# EasyEDA Pro project EasyEDAPro-Schematic.epro, schematic main, sheets 1 to 4 of 7

## Sheets
1 main_blocks: Create Date: 2024-01-20; Page Name: main_blocks.Schematic1; Project Name: flipper; Schematic Name: Schematic1; Update Date: 2024-01-20; Company: 嘉立创EDA; Page Size: A4; Version: V1.0
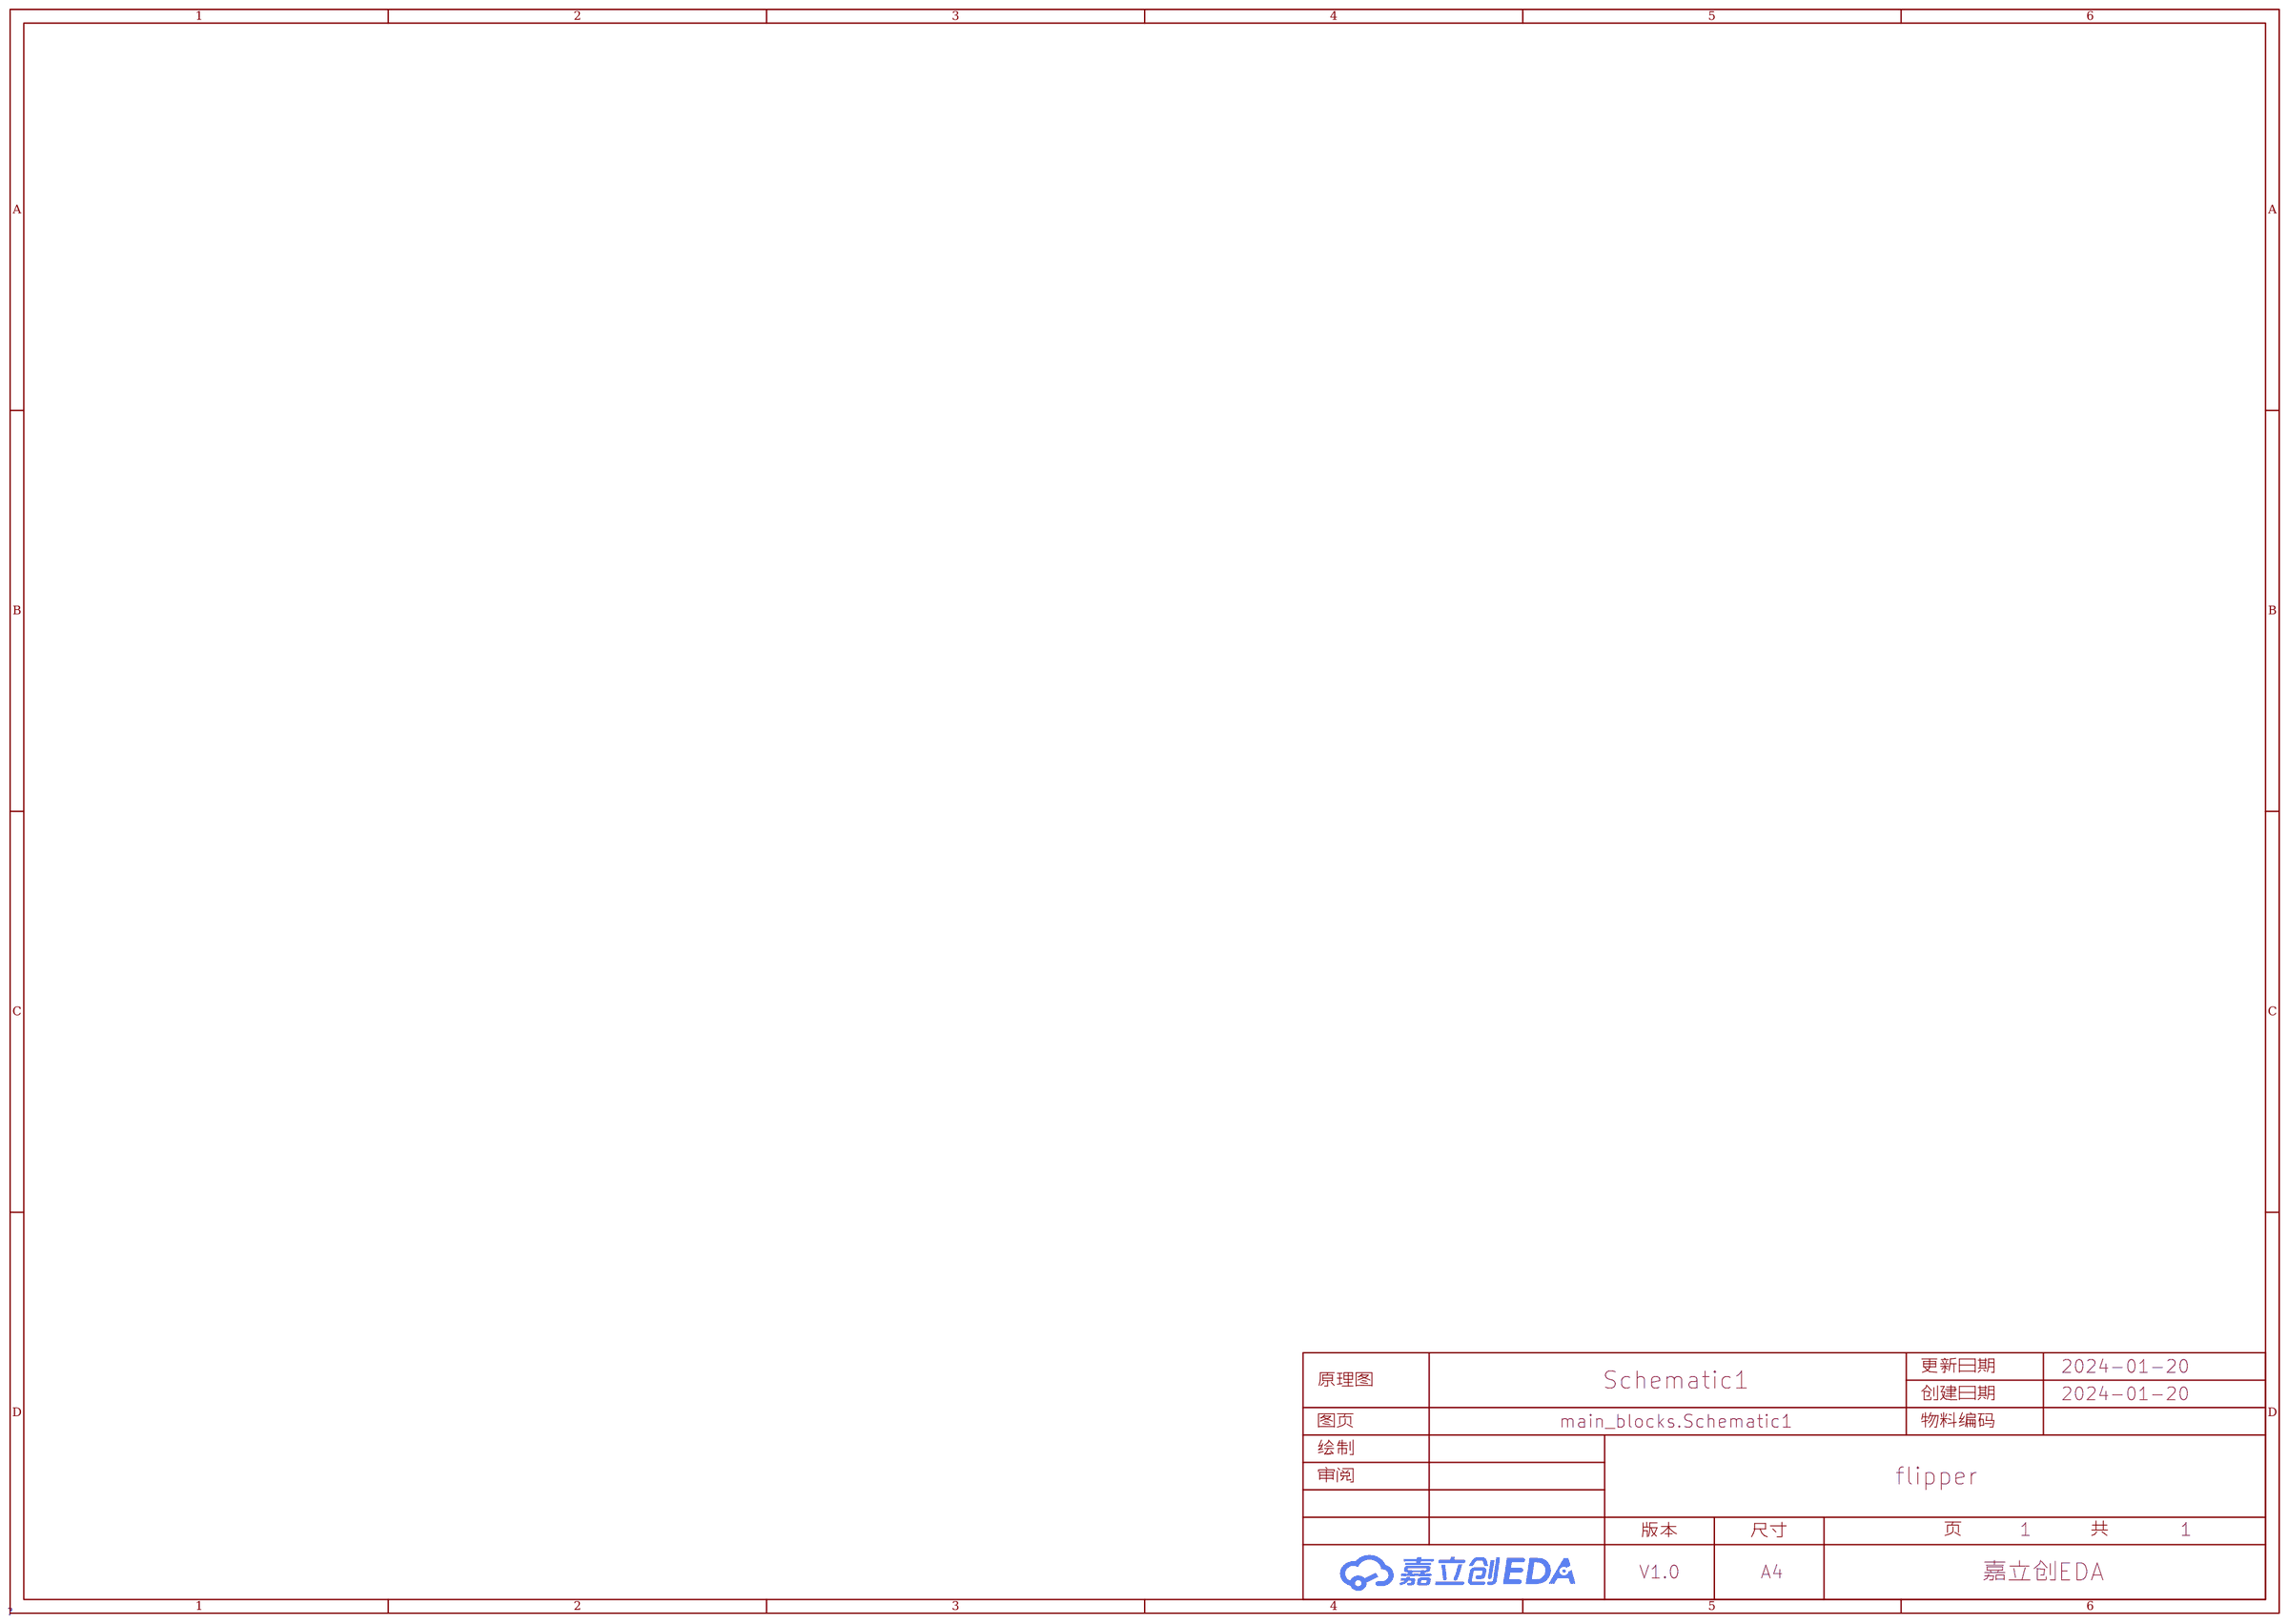
[diagram p0: main_blocks]
2 power: Page Name: power; Update Date: 2024-01-23
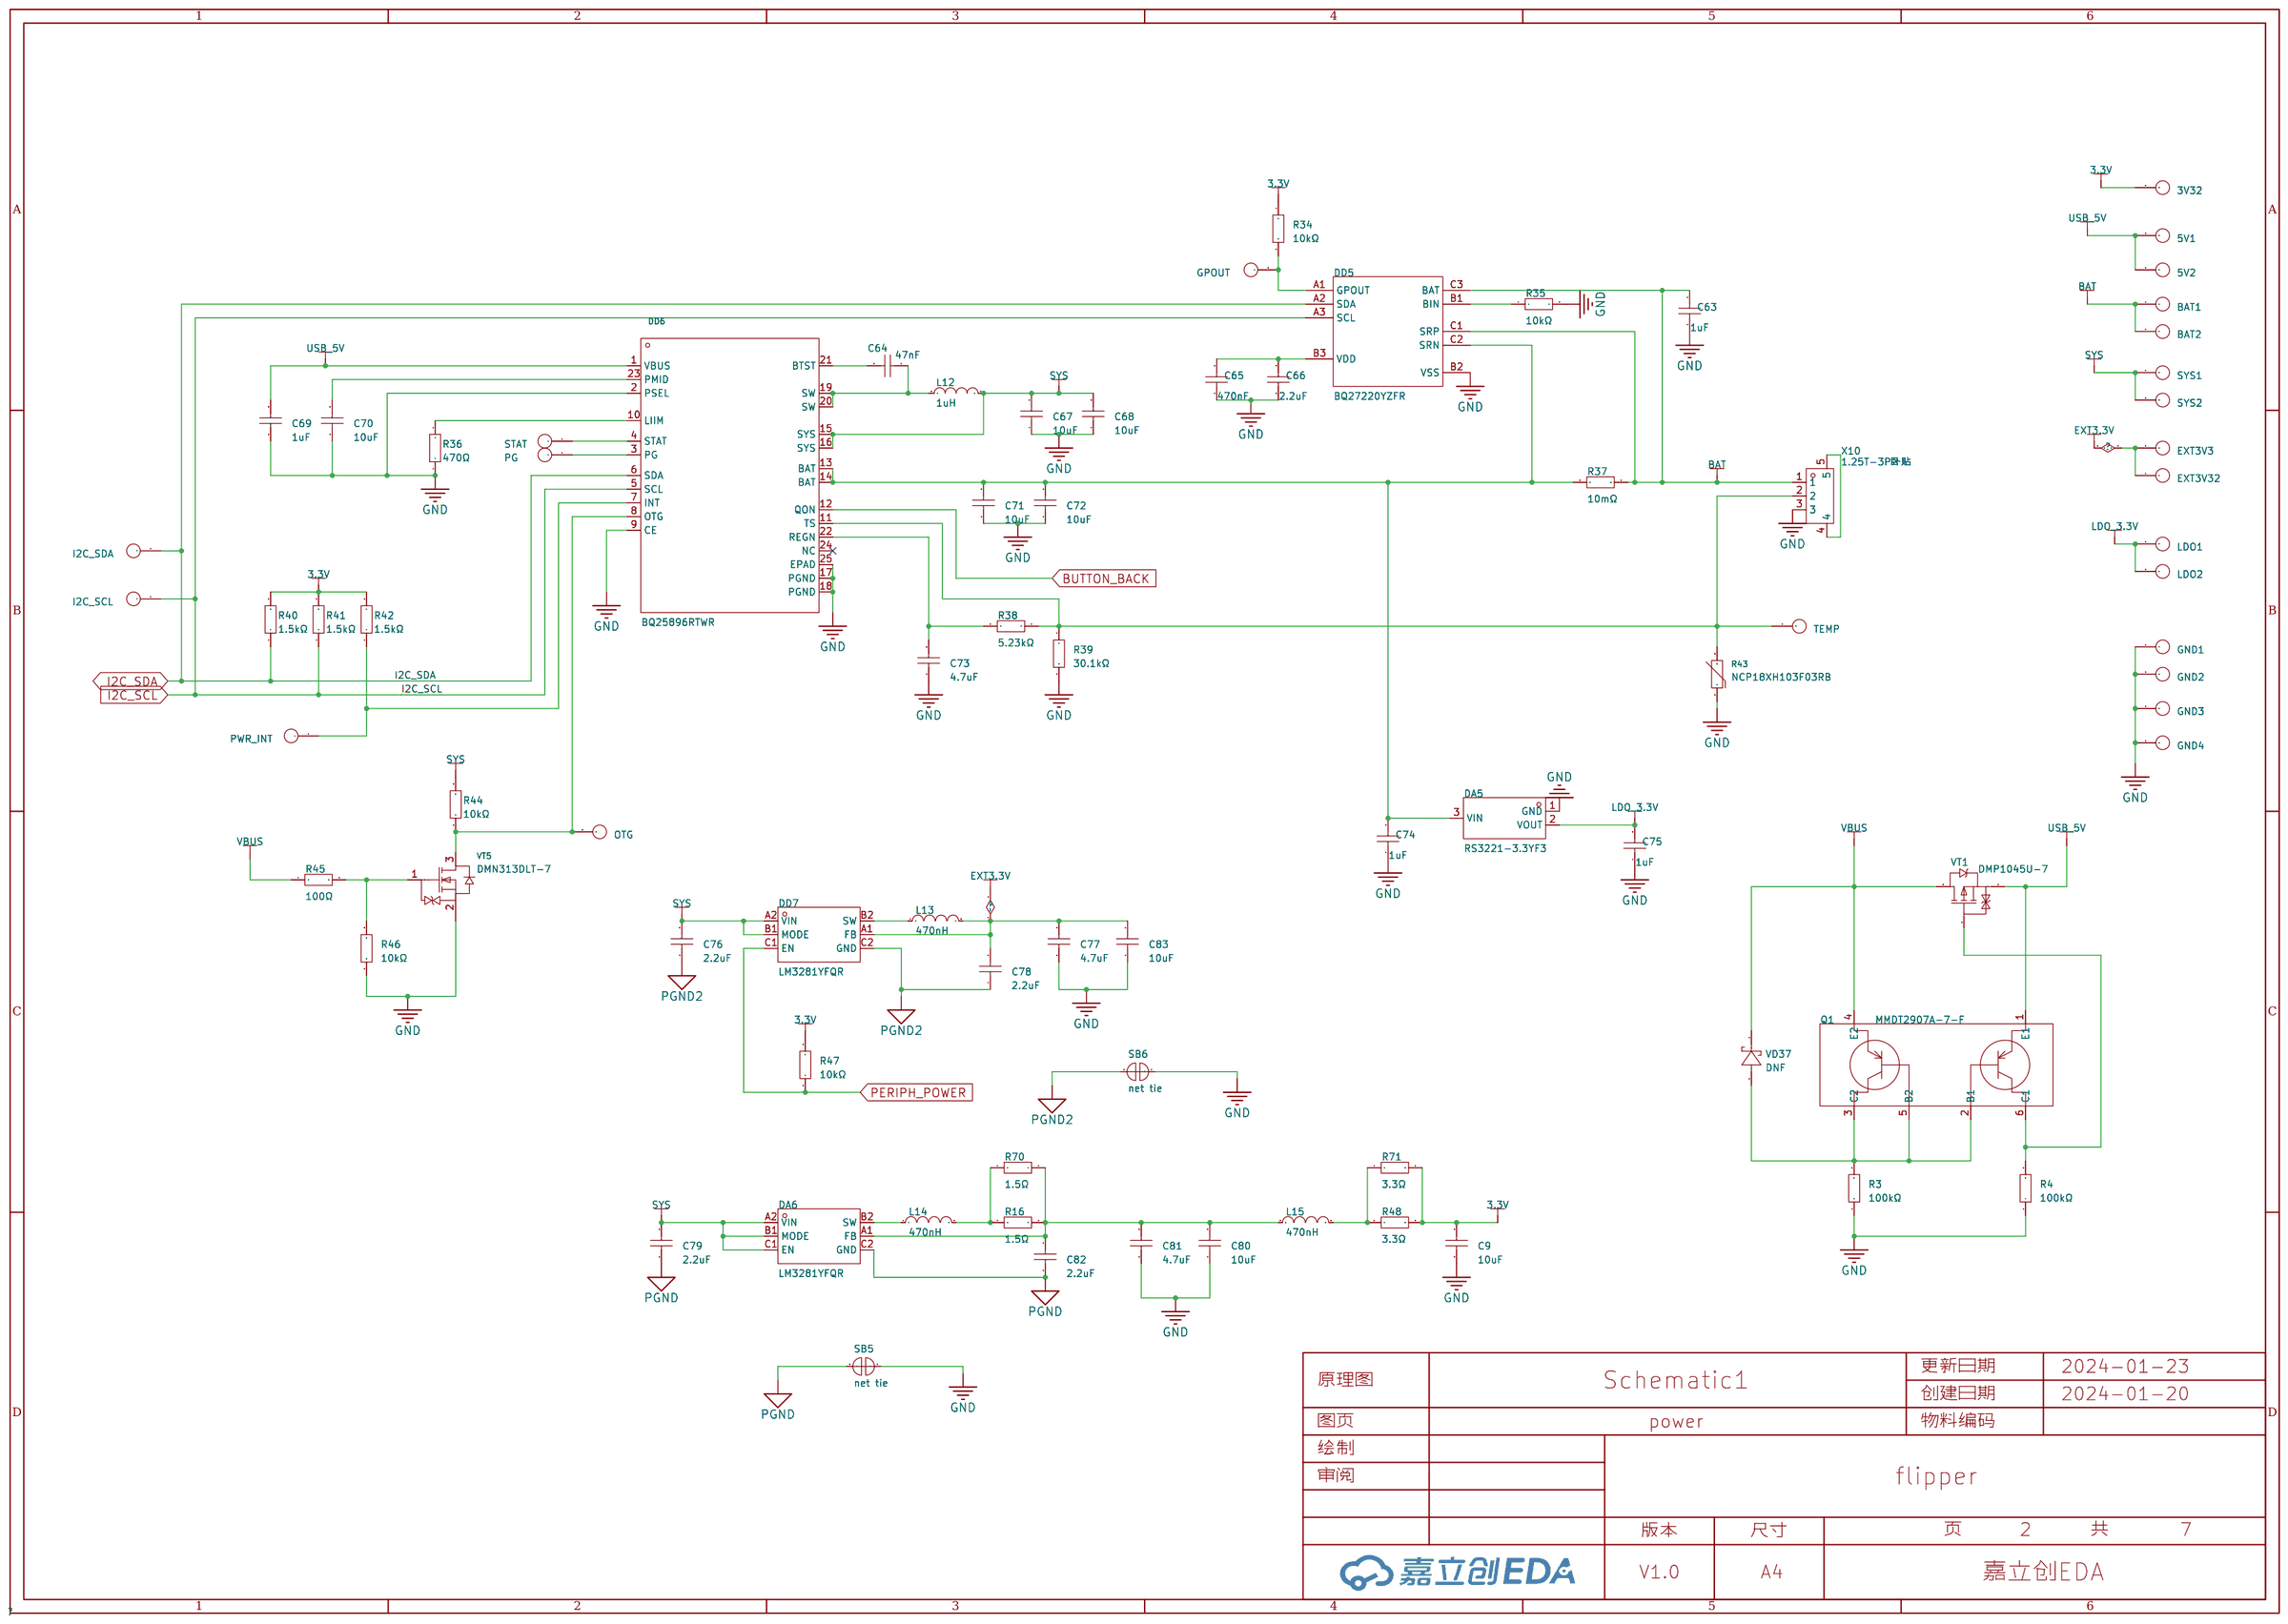
[diagram p1: power]
3 peripherals-schematic: Create Date: 2024-01-21; Page Name: peripherals-schematic; Update Date: 2024-01-23
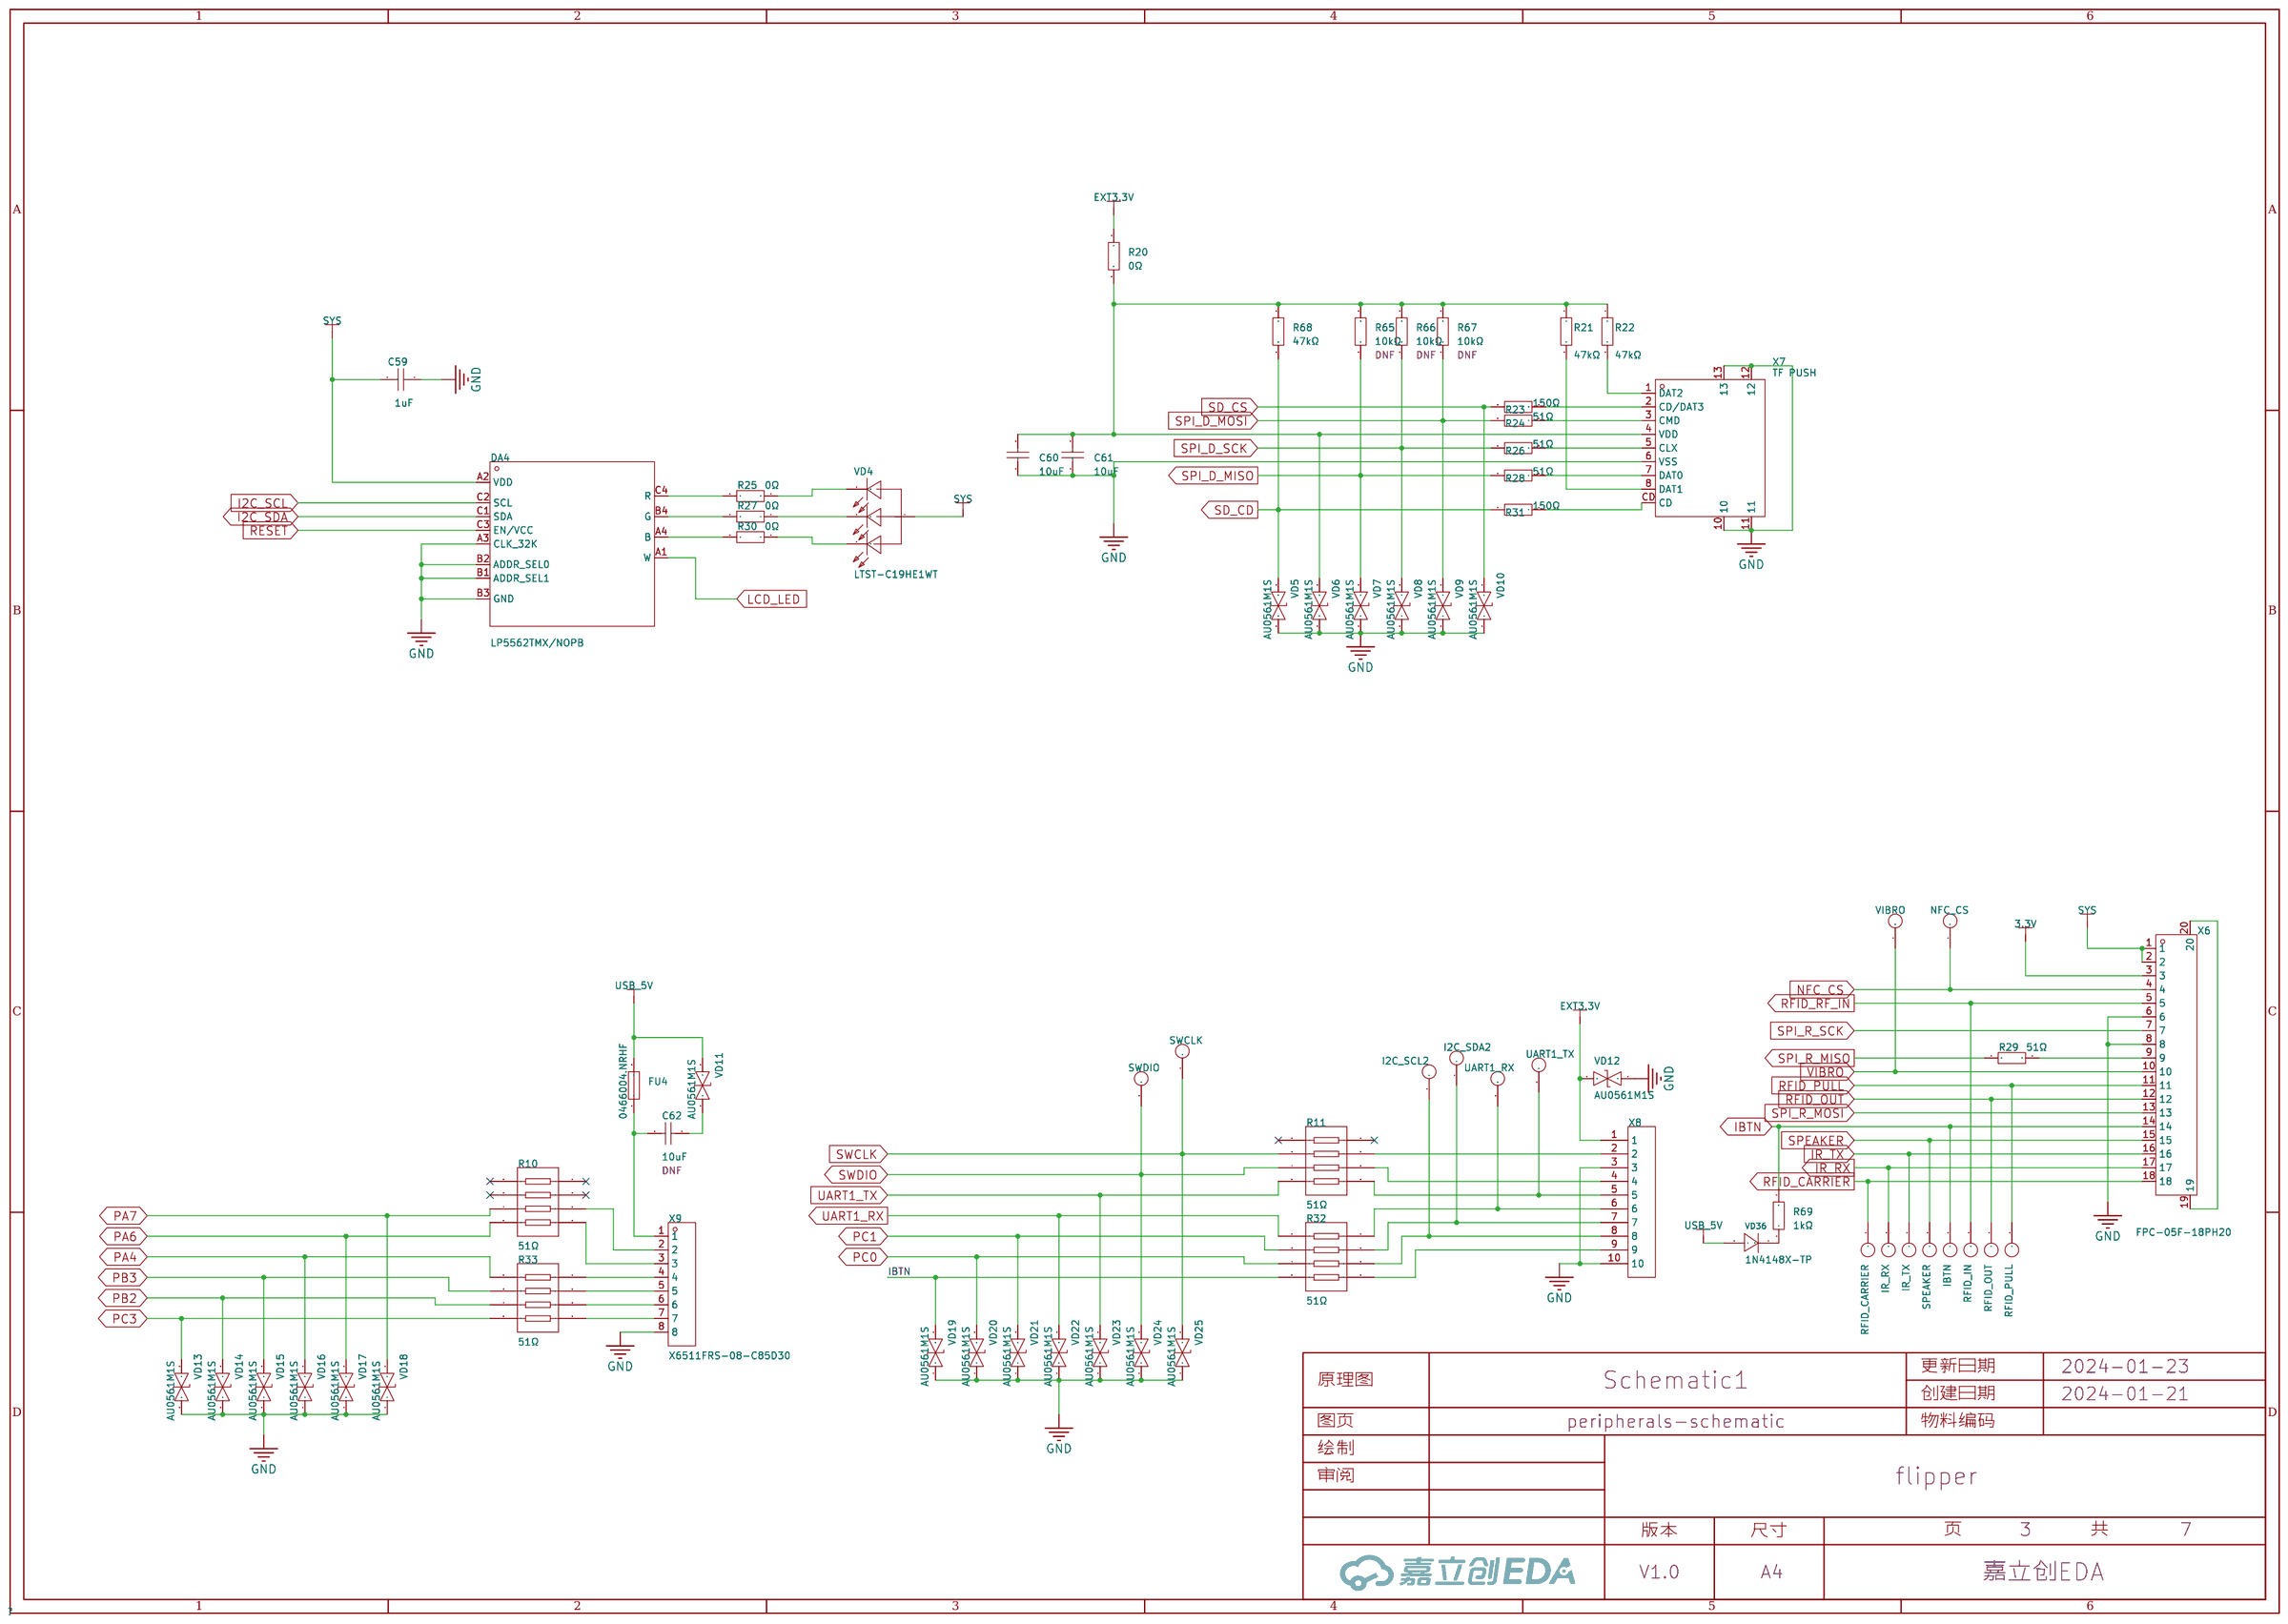
[diagram p2: peripherals-schematic]
4 mcu-stm32wb5: Create Date: 2024-01-21; Page Name: mcu-stm32wb5; Update Date: 2024-01-23
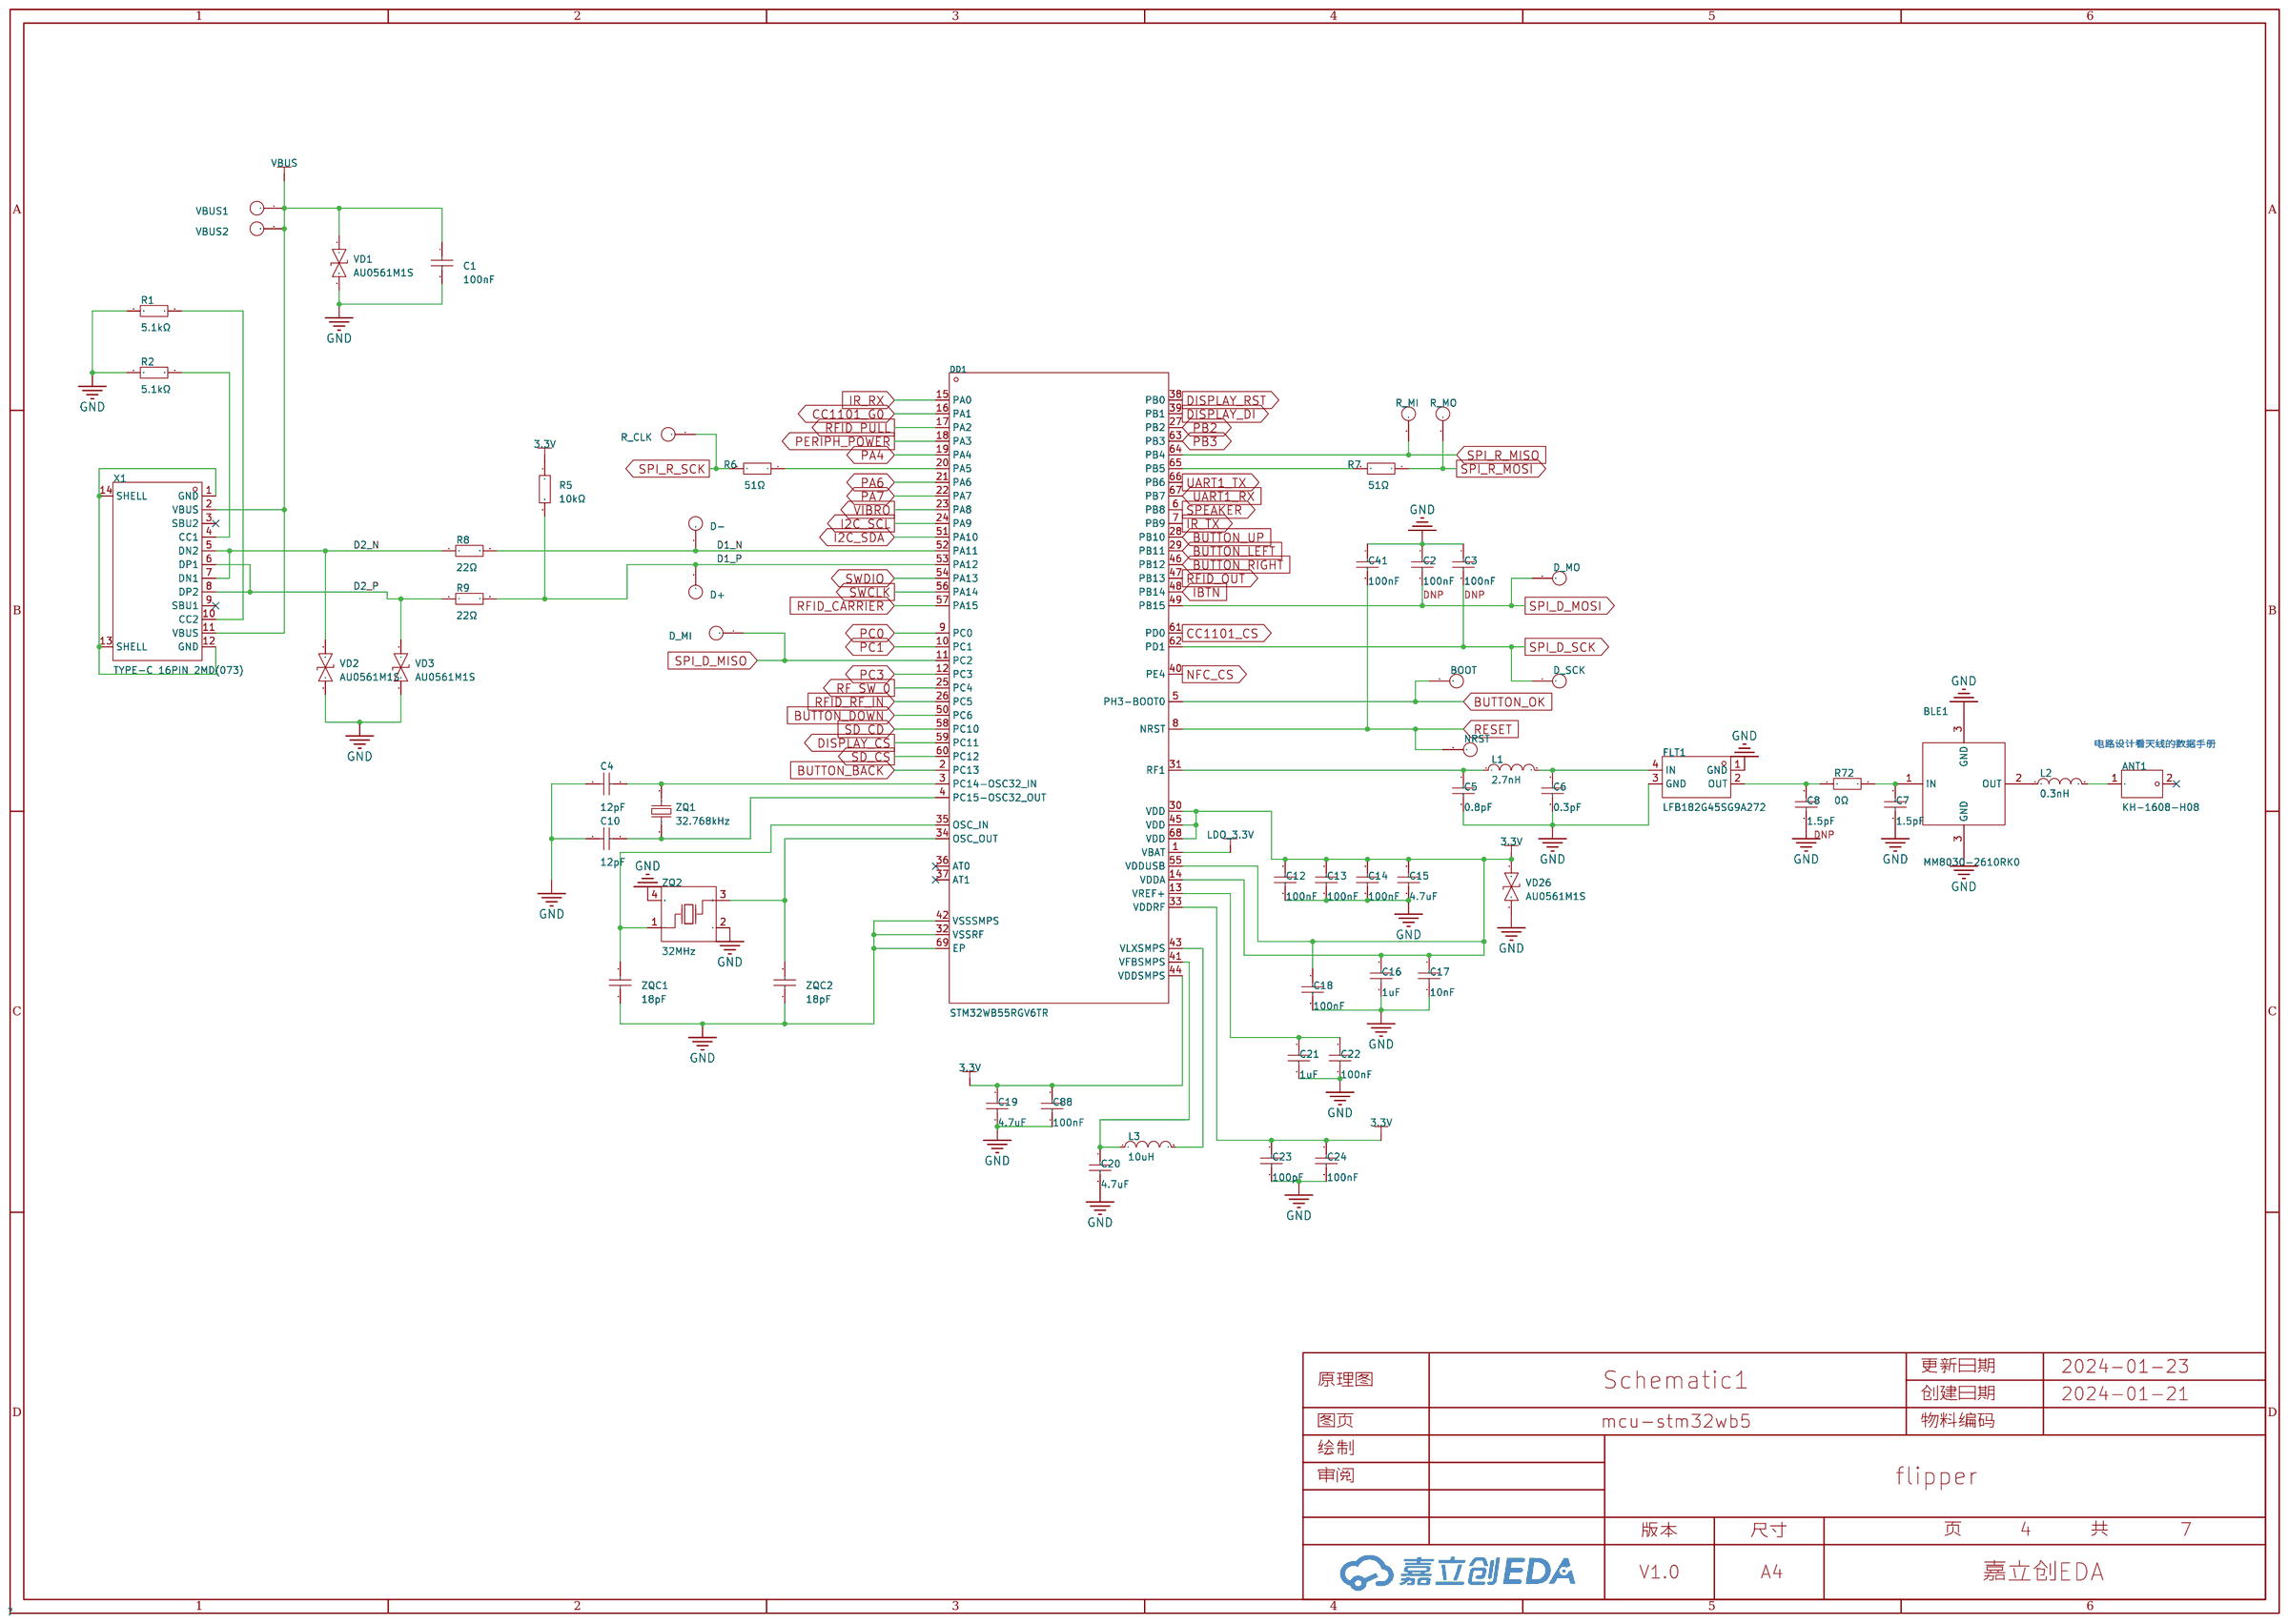
[diagram p3: mcu-stm32wb5]

## Parts
sheet mcu-stm32wb5
ANT1  KH-1608-H08  [ANT-SMD_L1.7-W0.9]
BLE1  MM8030-2610RK0  [RF-SMD_MM8030-2610RK0]
BOOT  -  [测试点0.8mm]
C1  100nF  [C0402]
C2  100nF  [C0402]  (no BOM)
C3  100nF  [C0402]  (no BOM)
C4  12pF  [C0402]
C5  0.8pF  [C0402]
C6  0.3pF  [C0402]
C7  1.5pF  [C0402]
C8  1.5pF  [C0402]  (no BOM)
C10  12pF  [C0402]
C12  100nF  [C0402]
C13  100nF  [C0402]
C14  100nF  [C0402]
C15  4.7uF  [C0402]
C16  1uF  [C0402]
C17  10nF  [C0402]
C18  100nF  [C0402]
C19  4.7uF  [C0402]
C20  4.7uF  [C0402]
C21  1uF  [C0402]
C22  100nF  [C0402]
C23  100pF  [C0402]
C24  100nF  [C0402]
C41  100nF  [C0402]
C88  100nF  [C0402]
D+  -  [测试点0.8mm]
D-  -  [测试点0.8mm]
D_MI  -  [测试点0.8mm]
D_MO  -  [测试点0.8mm]
D_SCK  -  [测试点0.8mm]
DD1  -  [QFN-68_L8.0-W8.0-P0.40-TL-EP6.4]
FLT1  LFB182G45SG9A272  [FILTER-SMD_0603-4P-L1.6-W0.8-T]
L1  2.7nH  [L0402]
L2  0.3nH  [L0402]
L3  10uH  [L0805]
NRST  -  [测试点0.8mm]
R1  5.1kΩ  [R0402]
R2  5.1kΩ  [R0402]
R5  10kΩ  [R0402]  (no BOM)
R6  51Ω  [R0402]
R7  51Ω  [R0402]
R8  22Ω  [R0402]
R9  22Ω  [R0402]
R72  0Ω  [R0402]
R_CLK  -  [测试点0.8mm]
R_MI  -  [测试点0.8mm]
R_MO  -  [测试点0.8mm]
VBUS1  -  [测试点0.8mm]
VBUS2  -  [测试点0.8mm]
VD1  AU0561M1S  [D0402-BI]
VD2  AU0561M1S  [D0402-BI]
VD3  AU0561M1S  [D0402-BI]
VD26  AU0561M1S  [D0402-BI]
X1  TYPE-C 16PIN 2MD(073)  [USB-C-SMD_TYPE-C-6PIN-2MD-073]
ZQ1  32.768kHz  [OSC-SMD_L3.2-W1.5]
ZQ2  32MHz  [CRYSTAL-SMD_4P-L2.0-W1.6-BL-2]
ZQC1  18pF  [C0402]
ZQC2  18pF  [C0402]
sheet peripherals-schematic
C59  1uF  [C0402]
C60  10uF  [C0603]
C61  10uF  [C0603]
C62  10uF  [C0603]  (no BOM)
DA4  LP5562TMX/NOPB  [DSBGA-12_L1.7-W1.3-R3-C4-P0.40-TL]
FU4  0466004.NRHF  [F1206]
I2C_SCL2  -  [测试点0.8mm]
I2C_SDA2  -  [测试点0.8mm]
IBTN  -  [测试点0.8mm]
IR_RX  -  [测试点0.8mm]
IR_TX  -  [测试点0.8mm]
NFC_CS  -  [测试点0.8mm]
R10  51Ω  [RES-ARRAY-SMD_0402-8P-L2.0-W1.0-BL]
R11  51Ω  [RES-ARRAY-SMD_0402-8P-L2.0-W1.0-BL]
R20  0Ω  [R0402]
R21  47kΩ  [R0402]
R22  47kΩ  [R0402]
R23  150Ω  [R0402]
R24  51Ω  [R0402]
R25  0Ω  [R0402]
R26  51Ω  [R0402]
R27  0Ω  [R0402]
R28  51Ω  [R0402]
R29  51Ω  [R0402]
R30  0Ω  [R0402]
R31  150Ω  [R0402]
R32  51Ω  [RES-ARRAY-SMD_0402-8P-L2.0-W1.0-BL]
R33  51Ω  [RES-ARRAY-SMD_0402-8P-L2.0-W1.0-BL]
R65  10kΩ  [R0402]  (no BOM)
R66  10kΩ  [R0402]  (no BOM)
R67  10kΩ  [R0402]  (no BOM)
R68  47kΩ  [R0402]
R69  1kΩ  [R0402]
RFID_CARRIER  -  [测试点0.8mm]
RFID_IN  -  [测试点0.8mm]
RFID_OUT  -  [测试点0.8mm]
RFID_PULL  -  [测试点0.8mm]
SPEAKER  -  [测试点0.8mm]
SWCLK  -  [测试点0.8mm]
SWDIO  -  [测试点0.8mm]
UART1_RX  -  [测试点0.8mm]
UART1_TX  -  [测试点0.8mm]
VD4  LTST-C19HE1WT  [LED-ARRAY-SMD_4P-L1.6-W1.6-TL-CW]
VD5  AU0561M1S  [D0402-BI]
VD6  AU0561M1S  [D0402-BI]
VD7  AU0561M1S  [D0402-BI]
VD8  AU0561M1S  [D0402-BI]
VD9  AU0561M1S  [D0402-BI]
VD10  AU0561M1S  [D0402-BI]
VD11  AU0561M1S  [D0402-BI]
VD12  AU0561M1S  [D0402-BI]
VD13  AU0561M1S  [D0402-BI]
VD14  AU0561M1S  [D0402-BI]
VD15  AU0561M1S  [D0402-BI]
VD16  AU0561M1S  [D0402-BI]
VD17  AU0561M1S  [D0402-BI]
VD18  AU0561M1S  [D0402-BI]
VD19  AU0561M1S  [D0402-BI]
VD20  AU0561M1S  [D0402-BI]
VD21  AU0561M1S  [D0402-BI]
VD22  AU0561M1S  [D0402-BI]
VD23  AU0561M1S  [D0402-BI]
VD24  AU0561M1S  [D0402-BI]
VD25  AU0561M1S  [D0402-BI]
VD36  1N4148X-TP  [SOD-523F_L1.2-W0.8-LS1.7-RD]
VIBRO  -  [测试点0.8mm]
X6  FPC-05F-18PH20  [FPC-SMD_18P-P0.50_FPC-05F-18PH20]
X7  TF PUSH  [TF-SMD_TF-PUSH]
X8  -  [HDR-SMD_10P-P2.54-H-F-L11.5]
X9  X6511FRS-08-C85D30  [HDR-SMD_8P-P2.54-H-F-L11.5]
sheet power
3V32  -  [测试点0.8mm]
5V1  -  [测试点0.8mm]
5V2  -  [测试点0.8mm]
BAT1  -  [测试点0.8mm]
BAT2  -  [测试点0.8mm]
C9  10uF  [C0603]
C63  1uF  [C0402]
C64  47nF  [C0402]
C65  470nF  [C0402]
C66  2.2uF  [C0603]
C67  10uF  [C0603]
C68  10uF  [C0603]
C69  1uF  [C0402]
C70  10uF  [C0603]
C71  10uF  [C0603]
C72  10uF  [C0603]
C73  4.7uF  [C0402]
C74  1uF  [C0402]
C75  1uF  [C0402]
C76  2.2uF  [C0603]
C77  4.7uF  [C0402]
C78  2.2uF  [C0603]
C79  2.2uF  [C0603]
C80  10uF  [C0603]
C81  4.7uF  [C0402]
C82  2.2uF  [C0603]
C83  10uF  [C0603]
DA5  RS3221-3.3YF3  [SOT-23-3_L2.9-W1.6-P1.90-LS2.8-BR]
DA6  LM3281YFQR  [DSBGA-6_L1.4-W1.1-R3-C2-P0.40-BL]
DD5  BQ27220YZFR  [DSBGA-9_L1.7-W1.6-R3-C3-P0.50-BL]
DD6  BQ25896RTWR  [QFN-24_L4.0-W4.0-P0.50-TL-EP2.7]
DD7  LM3281YFQR  [DSBGA-6_L1.4-W1.1-R3-C2-P0.40-BL]
EXT3V3  -  [测试点0.8mm]
EXT3V32  -  [测试点0.8mm]
GND1  -  [测试点0.8mm]
GND2  -  [测试点0.8mm]
GND3  -  [测试点0.8mm]
GND4  -  [测试点0.8mm]
GPOUT  -  [测试点0.8mm]
I2C_SCL  -  [测试点0.8mm]
I2C_SDA  -  [测试点0.8mm]
L12  1uH  [IND-SMD_L2.0-W1.6-B]
L13  470nH  [IND-SMD_L2.0-W1.6_MHCHL201610A-1R0M-Q8A]
L14  470nH  [IND-SMD_L2.0-W1.6_MHCHL201610A-1R0M-Q8A]
L15  470nH  [IND-SMD_L2.0-W1.6_MHCHL201610A-1R0M-Q8A]
LDO1  -  [测试点0.8mm]
LDO2  -  [测试点0.8mm]
OTG  -  [测试点0.8mm]
PG  -  [测试点0.8mm]
PWR_INT  -  [测试点0.8mm]
Q1  MMDT2907A-7-F  [SOT-363_L2.0-W1.3-P0.65-LS2.1-BL]
R3  100kΩ  [R0402]
R4  100kΩ  [R0402]
R16  1.5Ω  [R0402]
R34  10kΩ  [R0402]
R35  10kΩ  [R0402]
R36  470Ω  [R0402]
R37  10mΩ  [R2512]
R38  5.23kΩ  [R0402]
R39  30.1kΩ  [R0402]
R40  1.5kΩ  [R0402]
R41  1.5kΩ  [R0402]
R42  1.5kΩ  [R0402]
R43  NCP18XH103F03RB  [R0603]
R44  10kΩ  [R0402]
R45  100Ω  [R0402]
R46  10kΩ  [R0402]
R47  10kΩ  [R0402]
R48  3.3Ω  [R0402]
R70  1.5Ω  [R0402]
R71  3.3Ω  [R0402]
SB5  net tie  [Solderbridge_Shorted]
SB6  net tie  [Solderbridge_Shorted]
STAT  -  [测试点0.8mm]
SYS1  -  [测试点0.8mm]
SYS2  -  [测试点0.8mm]
TEMP  -  [测试点0.8mm]
VD37  DNF  [SOD-523_L1.2-W0.8-LS1.6-RD]
VT1  DMP1045U-7  [SOT-23-3_L2.9-W1.3-P1.90-LS2.4-BR]
VT5  DMN313DLT-7  [SOT-523-3_L1.6-W0.8-P1.00-LS1.6-BR]
X10  1.25T-3P卧贴  [CONN-SMD_3P-P1.25_1.25T-3PWT]

## Library data of the parts
ANT1 = KH-1608-H08: Supplier Part: C2925416; Manufacturer: kinghelm(金航标); Supplier Footprint: 0603; JLCPCB Part Class: 扩展库; Datasheet: https://atta.szlcsc.com/upload/public/pdf/source/20211126/3EE7BF0E326A51E5D543950E9041E299.pdf; Supplier: LCSC
BLE1 = MM8030-2610RK0: 连接器类型:板端;接口类型:内孔;端口数量:1;接口直径:1.35mm;接口长度/高度:0.45mm;频率-最大值:11GHz;射频系列:SWG;阻抗:50Ω;样式:-;工作温度范围:-;; LCSC Part Name: SWG 内孔; Supplier Part: C91632; Manufacturer: muRata(村田); Supplier Footprint: SMD; JLCPCB Part Class: Extended Part; Datasheet: https://atta.szlcsc.com/upload/public/pdf/source/20170103/1483439942333.pdf; Supplier: LCSC; Connector Type: 板端; Interface Type: 内孔; Number of Ports: 1; Interface Diameter: 1.35mm; Interface Length/Height: 0.45mm; Frequency-Max: 11GHz; RF Series: SWG; Impedance: 50Ω
3V32 5V1 5V2 BAT1 BAT2 BOOT D+ D- D_MI D_MO D_SCK EXT3V3 EXT3V32 GND1-GND4 GPOUT I2C_SCL I2C_SCL2 I2C_SDA I2C_SDA2 IBTN IR_RX IR_TX LDO1 LDO2 NFC_CS NRST OTG PG PWR_INT R_CLK R_MI R_MO RFID_CARRIER RFID_IN RFID_OUT RFID_PULL SPEAKER STAT SWCLK SWDIO SYS1 SYS2 TEMP UART1_RX UART1_TX VBUS1 VBUS2 VIBRO = 测试点: Check: false
C1 C12-C14 C18 C22 C24 C41 C88 = GRM155R71H104KE14D: 容值:100nF;精度:±10%;额定电压:50V;材质(温度系数):X7R;; LCSC Part Name: 100nF ±10% 50V; Supplier Part: C77020; Manufacturer: muRata(村田); Supplier Footprint: 0402; JLCPCB Part Class: Extended Part; Datasheet: https://atta.szlcsc.com/upload/public/pdf/source/20180326/C77020_39BD49C951FF1AF0DB1F1FAC5AC1E401.pdf; Supplier: LCSC; Tolerance: ±10%; Voltage Rated: 50V; Temperature Coefficient: X7R
C2 C3 = GRM155R71H104KE14D: 容值:100nF;精度:±10%;额定电压:50V;材质(温度系数):X7R;; LCSC Part Name: 100nF ±10% 50V; Supplier Part: C77020; Manufacturer: muRata(村田); Supplier Footprint: 0402; JLCPCB Part Class: Extended Part; Datasheet: https://atta.szlcsc.com/upload/public/pdf/source/20180326/C77020_39BD49C951FF1AF0DB1F1FAC5AC1E401.pdf; Supplier: LCSC; Tolerance: ±10%; Voltage Rated: 50V; Temperature Coefficient: X7R; Comment: DNP
C4 C10 = 0402CG120J500NT: 容值:12pF;精度:±5%;额定电压:50V;材质(温度系数):C0G;; LCSC Part Name: 12pF ±5% 50V; Supplier Part: C1547; Manufacturer: FH(风华); Supplier Footprint: 0402; JLCPCB Part Class: Basic Part; Datasheet: https://atta.szlcsc.com/upload/public/pdf/source/20200305/C486355_26A10D38EF8C2A5C37091D0039909270.pdf; Supplier: LCSC; Tolerance: ±5%; Voltage Rated: 50V; Temperature Coefficient: C0G
C5 = GJM1555C1HR80BB01D: 容值:0.8pF;额定电压:50V;材质(温度系数):C0G;; LCSC Part Name: 0.8pF 50V ±0.1pF; Supplier Part: C76915; Manufacturer: muRata(村田); Supplier Footprint: 0402; JLCPCB Part Class: Extended Part; Datasheet: https://atta.szlcsc.com/upload/public/pdf/source/20180307/C76915_15204090825531407705.pdf; Supplier: LCSC; Voltage Rated: 50V; Temperature Coefficient: C0G; Tolerance: ±10%
C6 = GJM1555C1HR30BB01D: 容值:0.3pF;额定电压:50V;材质(温度系数):C0G;; LCSC Part Name: 0.3pF 50V ±0.1pF; Supplier Part: C85885; Manufacturer: muRata(村田); Supplier Footprint: 0402; JLCPCB Part Class: Extended Part; Datasheet: https://atta.szlcsc.com/upload/public/pdf/source/20200305/C490387_23319AE8C154DEB24C505E6C82A8106A.pdf; Supplier: LCSC; Voltage Rated: 50V; Temperature Coefficient: C0G; Tolerance: ±10%
C7 = GJM1555C1H1R5WB01D: 容值:1.5pF;额定电压:50V;材质(温度系数):-;; LCSC Part Name: 1.5pF 50V ±0.05pF; Supplier Part: C76901; Manufacturer: muRata(村田); Supplier Footprint: 0402; JLCPCB Part Class: Extended Part; Datasheet: https://atta.szlcsc.com/upload/public/pdf/source/20180326/C76901_35AAC13796FF1C4F89C7FD46F40EAEE1.pdf; Supplier: LCSC; Voltage Rated: 50V; Tolerance: ±10%
C8 = CC0402BRNPO9BN1R5: 容值:1.5pF;额定电压:50V;材质(温度系数):NP0;; LCSC Part Name: 1.5pF 50V ±0.1pF; Supplier Part: C282238; Manufacturer: YAGEO(国巨); Supplier Footprint: 0402; JLCPCB Part Class: Extended Part; Datasheet: https://atta.szlcsc.com/upload/public/pdf/source/20181008/C309499_21CC21451B82C39E3D92150FD6B30293.pdf; Supplier: LCSC; Voltage Rated: 50V; Temperature Coefficient: NP0; Tolerance: ±10%; Comment: DNP
C15 C19 C20 C73 C77 C81 = CL05A475KP5NRNC: 容值:4.7uF;精度:±10%;额定电压:10V;材质(温度系数):X5R;; LCSC Part Name: 4.7uF ±10% 10V; Supplier Part: C368809; Manufacturer: SAMSUNG(三星); Supplier Footprint: 0402; JLCPCB Part Class: Extended Part; Datasheet: https://atta.szlcsc.com/upload/public/pdf/source/20160218/1457707763339.pdf; Supplier: LCSC; Tolerance: ±10%; Voltage Rated: 10V; Temperature Coefficient: X5R
C16 C21 C59 C63 C69 C74 C75 = CL05A105KA5NQNC: 容值:1uF;精度:±10%;额定电压:25V;材质(温度系数):X5R;; LCSC Part Name: 1uF ±10% 25V; Supplier Part: C52923; Manufacturer: SAMSUNG(三星); Supplier Footprint: 0402; JLCPCB Part Class: Basic Part; Datasheet: https://atta.szlcsc.com/upload/public/pdf/source/20160218/1457707763339.pdf; Supplier: LCSC; Tolerance: ±10%; Voltage Rated: 25V; Temperature Coefficient: X5R
C17 = CC0402KRX7R9BB103: 容值:10nF;精度:±10%;额定电压:50V;材质(温度系数):X7R;; LCSC Part Name: 10nF ±10% 50V; Supplier Part: C60133; Manufacturer: YAGEO(国巨); Supplier Footprint: 0402; JLCPCB Part Class: Extended Part; Datasheet: https://atta.szlcsc.com/upload/public/pdf/source/20180224/C181747_15194369449651363981.pdf; Supplier: LCSC; Tolerance: ±10%; Voltage Rated: 50V; Temperature Coefficient: X7R
C23 = 0402CG101J500NT: 容值:100pF;精度:±5%;额定电压:50V;材质(温度系数):C0G;; LCSC Part Name: 100pF ±5% 50V; Supplier Part: C1546; Manufacturer: FH(风华); Supplier Footprint: 0402; JLCPCB Part Class: Basic Part; Datasheet: https://atta.szlcsc.com/upload/public/pdf/source/20200305/C486355_26A10D38EF8C2A5C37091D0039909270.pdf; Supplier: LCSC; Tolerance: ±5%; Voltage Rated: 50V; Temperature Coefficient: C0G
DD1 = STM32WB55RGV6TR: 应用领域:802.15.4,蓝牙;频率范围:2.405GHz~2.48GHz;数据速率:2Mbps;灵敏度:-100dBm;接口:ADC,I2C,SPI,UART,USART,USB;; Supplier: LCSC; Supplier Part: C2151757; Manufacturer: ST(意法半导体); JLCPCB Part Class: 扩展库; Supplier Footprint: VFQFPN-68(8x8); Datasheet: https://atta.szlcsc.com/upload/public/pdf/source/20210601/5432F19F1D5A2A3CB39F31675BD897C7.pdf; Applications: 802.15.4,蓝牙; Operating Voltage: 1.71V~3.6V; Frequency Range: 2.405GHz~2.48GHz; Current Of Transmitting: 5.2mA; Receive Current: 4.5mA; Data Rate: 2Mbps; Sensitivity: -100dBm; Interface: ADC,I2C,SPI,UART,USART,USB; Output Power: 6dBm; Operating Temperature: -40℃~+85℃
FLT1 = LFB182G45SG9A272: LCSC Part Name: 2.45GHZ BAND; Supplier Part: C397307; Manufacturer: muRata(村田); Supplier Footprint: 0603; JLCPCB Part Class: 扩展库; Datasheet: https://atta.szlcsc.com/upload/public/pdf/source/20190712/C397307_B407E9E6A692CC0066BE9D714FE4B20D.pdf; Supplier: LCSC
L1 = LQG15HS2N7B02D: 电感值:2.7nH;精度:-;额定电流:800mA;直流电阻(DCR):120mΩ;饱和电流(Isat):-;; Supplier Part: C162541; Manufacturer: muRata(村田); Supplier Footprint: 0402; JLCPCB Part Class: Extended Part; Datasheet: https://atta.szlcsc.com/upload/public/pdf/source/20190301/C337910_27DA25781C95F885577870A93A746ADF.pdf; Supplier: LCSC; Rated Current: 800mA; DC Resistance (DCR): 120mΩ; Q @ Freq: 8@100MHz; Frequency - Self Resonant: 6GHz
L2 = MLG1005S0N3CT000: 电感值:0.3nH;精度:-;额定电流:1A;直流电阻(DCR):10mΩ;饱和电流(Isat):-;; Supplier Part: C387859; Manufacturer: TDK; Supplier Footprint: 0402; JLCPCB Part Class: Extended Part; Datasheet: https://atta.szlcsc.com/upload/public/pdf/source/20190419/C387859_5DE6ADE2B9677DA772C969475E4B719D.pdf; Supplier: LCSC; Rated Current: 1A; DC Resistance (DCR): 10mΩ; Frequency - Self Resonant: 10GHz
L3 = CMI201209X100KT: 电感值:10uH;精度:±10%;额定电流:15mA;饱和电流(Isat):-;直流电阻(DCR):1.15Ω;; LCSC Part Name: 10uH ±10% 1.15Ω; Supplier Part: C99366; Manufacturer: FH(风华); Supplier Footprint: 0805; JLCPCB Part Class: 扩展库; Datasheet: https://atta.szlcsc.com/upload/public/pdf/source/20230223/B5A9234764BD8EE53116685FAFCB16FA.pdf; Supplier: LCSC; Tolerance: ±10%; Rated Current: 15mA; DC Resistance (DCR): 1.15Ω; Q @ Freq: 30@2MHz; Frequency - Self Resonant: 24MHz
R1 R2 = 0402WGF5101TCE: 阻值:5.1kΩ;精度:±1%;功率:62.5mW;温度系数:±100ppm/℃;电阻类型:厚膜电阻;; LCSC Part Name: 5.1kΩ ±1% 62.5mW 厚膜电阻; Supplier Part: C25905; Manufacturer: UNI-ROYAL(厚声); Supplier Footprint: 0402; JLCPCB Part Class: Basic Part; Datasheet: https://atta.szlcsc.com/upload/public/pdf/source/20200306/C422600_1E6D84923E4A46A82E41ADD87F860B5C.pdf; Supplier: LCSC; Tolerance: ±1%; Power(Watts): 62.5mW; Overload Voltage (Max): 50V; Temperature Coefficient: ±100ppm/℃; Type: 厚膜电阻; Operating Temperature Range: -55℃~+155℃
R5 R65-R67 = RC0402FR-0710KL: 电阻类型:厚膜电阻;阻值:10kΩ;精度:±1%;功率:62.5mW;; LCSC Part Name: 10kΩ ±1% 62.5mW; Supplier Part: C60490; Manufacturer: YAGEO(国巨); Supplier Footprint: 0402; JLCPCB Part Class: Extended Part; Datasheet: https://atta.szlcsc.com/upload/public/pdf/source/20170606/1496716515432.pdf; Supplier: LCSC; Type: 厚膜电阻; Tolerance: ±1%; Power(Watts): 62.5mW; Temperature Coefficient: ±100ppm/℃; Overload Voltage (Max): 50V; Operating Temperature Range: -55℃~+155℃; Comment: DNF
R6 R7 R24 R26 R28 R29 = 0402WGF510JTCE: 阻值:51Ω;精度:±1%;功率:62.5mW;温度系数:±100ppm/℃;电阻类型:厚膜电阻;; LCSC Part Name: 51Ω ±1% 62.5mW 厚膜电阻; Supplier Part: C25125; Manufacturer: UNI-ROYAL(厚声); Supplier Footprint: 0402; JLCPCB Part Class: Basic Part; Datasheet: https://atta.szlcsc.com/upload/public/pdf/source/20200306/C422600_1E6D84923E4A46A82E41ADD87F860B5C.pdf; Supplier: LCSC; Tolerance: ±1%; Power(Watts): 62.5mW; Overload Voltage (Max): 50V; Temperature Coefficient: ±100ppm/℃; Type: 厚膜电阻; Operating Temperature Range: -55℃~+155℃
R8 R9 = 0402WGF220JTCE: 阻值:22Ω;精度:±1%;功率:62.5mW;温度系数:±100ppm/℃;电阻类型:厚膜电阻;; LCSC Part Name: 22Ω ±1% 62.5mW 厚膜电阻; Supplier Part: C25092; Manufacturer: UNI-ROYAL(厚声); Supplier Footprint: 0402; JLCPCB Part Class: Basic Part; Datasheet: https://atta.szlcsc.com/upload/public/pdf/source/20200306/C422600_1E6D84923E4A46A82E41ADD87F860B5C.pdf; Supplier: LCSC; Tolerance: ±1%; Power(Watts): 62.5mW; Overload Voltage (Max): 50V; Temperature Coefficient: ±100ppm/℃; Type: 厚膜电阻; Operating Temperature Range: -55℃~+155℃
R72 = 0402WGF0000TCE: 阻值:0Ω;精度:±1%;功率:62.5mW;温度系数:±800ppm/℃;电阻类型:厚膜电阻;; LCSC Part Name: 0Ω ±1% 62.5mW 厚膜电阻; Supplier Part: C17168; Manufacturer: UNI-ROYAL(厚声); Supplier Footprint: 0402; JLCPCB Part Class: 基础库; Datasheet: https://atta.szlcsc.com/upload/public/pdf/source/20200306/C422600_1E6D84923E4A46A82E41ADD87F860B5C.pdf; Supplier: LCSC; Tolerance: ±1%; Power(Watts): 62.5mW; Overload Voltage (Max): 50V; Temperature Coefficient: ±800ppm/℃; Type: 厚膜电阻; Operating Temperature Range: -55℃~+155℃
VD1-VD3 VD5-VD26 = AU0561M1S: 反向截止电压(Vrwm):5V@Max;最大钳位电压:10V;峰值脉冲电流(Ipp)@10/1000us:-;峰值脉冲功率(Ppp)@10/1000us:-;击穿电压:6V;; LCSC Part Name: 双向TVS 5V截止; Supplier Part: C3002761; Manufacturer: Applied Power(应能微); Supplier Footprint: 0402; JLCPCB Part Class: 扩展库; Datasheet: https://atta.szlcsc.com/upload/public/pdf/source/20220507/27E0F5E1FB204E6E73732074B4278B9F.pdf; Supplier: LCSC; Reverse Stand-Off Voltage (Vrwm): 5V@Max; Maximum Clamping Voltage: 10V; Breakdown Voltage: 6V; Reverse Leakage Current (Ir): 200nA; Type: TVS
X1 = TYPE-C 16PIN 2MD(073): 连接器类型:Type-C;标准:-;公母:母;端口数量:1;触点数量:16P;安装方式:卧贴;额定电流 - 电源:5A;工作温度范围:-25℃~+85℃;; LCSC Part Name: Type-C 母 卧贴; Supplier Part: C2765186; Manufacturer: SHOU HAN(首韩); Supplier Footprint: SMD; JLCPCB Part Class: 扩展库; Datasheet: https://atta.szlcsc.com/upload/public/pdf/source/20211123/39B17C16241EAC15C5E277BDA434118E.pdf; Supplier: LCSC; Connector Type: Type-C; Gender: 母; Number of Ports: 1; Number of Contacts: 16P; Mounting Style: 卧贴; Current Rating - Power (Max): 5A; Operating Temperature Range: -25℃~+85℃
ZQ1 = SC-32S32.768kHz20PPM12.5pF: 频率:32.768kHz;负载电容:12.5pF;频率公差:±20ppm;; LCSC Part Name: 32.768kHz ±20ppm 12.5pF; Supplier Part: C97606; Manufacturer: Seiko(精工); Supplier Footprint: SMD3215-2P; JLCPCB Part Class: 扩展库; Datasheet: https://atta.szlcsc.com/upload/public/pdf/source/20170713/C97606_1499914220652816606.pdf; Supplier: LCSC; Load Capacitance: 12.5pF; Frequency Tolerance: ±20ppm
ZQ2 = XL7EL89COI-111YLC-32M: 频率:32MHz;负载电容:12pF;频率公差:±10ppm;; LCSC Part Name: 32MHz ±10ppm 12pF YSX211SL; Supplier Part: C2965584; Manufacturer: YXC(扬兴晶振); Supplier Footprint: SMD2016-4P; JLCPCB Part Class: Extended Part; Datasheet: https://atta.szlcsc.com/upload/public/pdf/source/20220121/6B4B3E7EF7974858943D806BF8CACEA3.pdf; Supplier: LCSC; Crystal Type: 贴片无源晶振; Load Capacitance: 12pF; Frequency Tolerance: ±10ppm; Frequency Stability: ±20ppm; Operating Temperature: -40℃~+85℃
ZQC1 ZQC2 = 0402CG180J500NT: 容值:18pF;精度:±5%;额定电压:50V;材质(温度系数):C0G;; LCSC Part Name: 18pF ±5% 50V; Supplier Part: C1549; Manufacturer: FH(风华); Supplier Footprint: 0402; JLCPCB Part Class: Basic Part; Datasheet: https://atta.szlcsc.com/upload/public/pdf/source/20200305/C486355_26A10D38EF8C2A5C37091D0039909270.pdf; Supplier: LCSC; Tolerance: ±5%; Voltage Rated: 50V; Temperature Coefficient: C0G
C9 C60 C61 C67 C68 C70-C72 C80 C83 = CL10A106MA8NRNC: 容值:10uF;精度:±20%;额定电压:25V;材质(温度系数):X5R;; LCSC Part Name: 10uF ±20% 25V; Supplier Part: C96446; Manufacturer: SAMSUNG(三星); Supplier Footprint: 0603; JLCPCB Part Class: Basic Part; Datasheet: https://atta.szlcsc.com/upload/public/pdf/source/20160218/1457707763339.pdf; Supplier: LCSC; Tolerance: ±20%; Voltage Rated: 25V; Temperature Coefficient: X5R
C62 = CL10A106MO8NQNC: 容值:10uF;精度:±20%;额定电压:16V;材质(温度系数):X5R;; LCSC Part Name: 10uF ±20% 16V; Supplier Part: C92487; Manufacturer: SAMSUNG(三星); Supplier Footprint: 0603; JLCPCB Part Class: Extended Part; Datasheet: https://atta.szlcsc.com/upload/public/pdf/source/20221212/2AEE4C8656EA91AC055807CAAFF57F96.pdf; Supplier: LCSC; Tolerance: ±20%; Voltage Rated: 16V; Temperature Coefficient: X5R; Comment: DNF
DA4 = LP5562TMX/NOPB: 类型:线性;通道数:4;输入电压:2.7V~5.5V;开关频率:558Hz；256Hz;输出电流:25.5mA;; Supplier Part: C544465; Manufacturer: TI(德州仪器); Supplier Footprint: BGA-12; JLCPCB Part Class: 扩展库; Supplier: LCSC; Type: 线性; Channels: 4; Input Voltage: 2.7V~5.5V; Switch Frequency: 558Hz；256Hz; Output Current: 25.5mA; Dimming: I2C; Operating temperature: -40℃~+85℃
FU4 = 0466004.NRHF: 类型:贴片式保险丝;额定电流:4A;额定电压 (AC):32V;额定电压 (DC):32V;分断能力:50A;; LCSC Part Name: 4A 32V 快断; Supplier Part: C187596; Manufacturer: Littelfuse(美国力特); Supplier Footprint: 1206; JLCPCB Part Class: 扩展库; Datasheet: https://atta.szlcsc.com/upload/public/pdf/source/20180530/C187596_E2DFCC1C93750F205789229184EB1171.pdf; Supplier: LCSC; Type: 贴片式保险丝; Current Rating: 4A; Voltage Rating  (AC): 32V; Voltage Rating (DC): 32V; Breaking Capacity: 50A; Operating Temperature: -55℃~+90℃
R10 R11 R32 R33 = 4D02WGJ0510TCE: 阻值:51Ω;精度:±5%;单个元件功率:62.5mW;电阻器数:4;温度系数:±200ppm/℃;; LCSC Part Name: 51Ω ±5%; Supplier Part: C25503; Manufacturer: UNI-ROYAL(厚声); Supplier Footprint: 0402x4; JLCPCB Part Class: Extended Part; Datasheet: https://atta.szlcsc.com/upload/public/pdf/source/20191224/C474318_2527498AE30E813171187CCD28401A71.pdf; Supplier: LCSC; Tolerance: ±5%; Power(Watts): 62.5mW; Number of Resistors: 4; Temperature Coefficient: ±200ppm/℃; Number of Pins: 8
R20 R25 R27 R30 = 0402WGF0000TCE: 阻值:0Ω;精度:±1%;功率:62.5mW;温度系数:±800ppm/℃;电阻类型:厚膜电阻;; LCSC Part Name: 0Ω ±1% 62.5mW 厚膜电阻; Supplier Part: C17168; Manufacturer: UNI-ROYAL(厚声); Supplier Footprint: 0402; JLCPCB Part Class: Basic Part; Datasheet: https://atta.szlcsc.com/upload/public/pdf/source/20200306/C422600_1E6D84923E4A46A82E41ADD87F860B5C.pdf; Supplier: LCSC; Tolerance: ±1%; Power(Watts): 62.5mW; Overload Voltage (Max): 50V; Temperature Coefficient: ±800ppm/℃; Type: 厚膜电阻; Operating Temperature Range: -55℃~+155℃
R21 R22 R68 = 0402WGF4702TCE: 阻值:47kΩ;精度:±1%;功率:62.5mW;温度系数:±100ppm/℃;电阻类型:厚膜电阻;; LCSC Part Name: 47kΩ ±1% 62.5mW 厚膜电阻; Supplier Part: C25792; Manufacturer: UNI-ROYAL(厚声); Supplier Footprint: 0402; JLCPCB Part Class: Basic Part; Datasheet: https://atta.szlcsc.com/upload/public/pdf/source/20200306/C422600_1E6D84923E4A46A82E41ADD87F860B5C.pdf; Supplier: LCSC; Tolerance: ±1%; Power(Watts): 62.5mW; Overload Voltage (Max): 50V; Temperature Coefficient: ±100ppm/℃; Type: 厚膜电阻; Operating Temperature Range: -55℃~+155℃
R23 R31 = 0402WGF1500TCE: 阻值:150Ω;精度:±1%;功率:62.5mW;温度系数:±100ppm/℃;电阻类型:厚膜电阻;; LCSC Part Name: 150Ω ±1% 62.5mW 厚膜电阻; Supplier Part: C25082; Manufacturer: UNI-ROYAL(厚声); Supplier Footprint: 0402; JLCPCB Part Class: Basic Part; Datasheet: https://atta.szlcsc.com/upload/public/pdf/source/20200306/C422600_1E6D84923E4A46A82E41ADD87F860B5C.pdf; Supplier: LCSC; Tolerance: ±1%; Power(Watts): 62.5mW; Overload Voltage (Max): 50V; Temperature Coefficient: ±100ppm/℃; Type: 厚膜电阻; Operating Temperature Range: -55℃~+155℃
R69 = 0402WGF1001TCE: 阻值:1kΩ;精度:±1%;功率:62.5mW;温度系数:±100ppm/℃;电阻类型:厚膜电阻;; LCSC Part Name: 1kΩ ±1% 62.5mW 厚膜电阻; Supplier Part: C11702; Manufacturer: UNI-ROYAL(厚声); Supplier Footprint: 0402; JLCPCB Part Class: Basic Part; Datasheet: https://atta.szlcsc.com/upload/public/pdf/source/20200306/C422600_1E6D84923E4A46A82E41ADD87F860B5C.pdf; Supplier: LCSC; Tolerance: ±1%; Power(Watts): 62.5mW; Overload Voltage (Max): 50V; Temperature Coefficient: ±100ppm/℃; Type: 厚膜电阻; Operating Temperature Range: -55℃~+155℃
VD4 = LTST-C19HE1WT: Supplier Part: C458749; Manufacturer: LITEON(光宝); Supplier Footprint: 0606; JLCPCB Part Class: 扩展库; Datasheet: https://atta.szlcsc.com/upload/public/pdf/source/20220425/318D431BC432BE6F4D7B552228925205.pdf; Supplier: LCSC
VD36 = 1N4148X-TP: 二极管配置:-;功率:-;直流反向耐压(Vr):75V;平均整流电流(Io):150mA;正向压降(Vf):1.25V@150mA;反向恢复时间(trr):4ns;; LCSC Part Name: 电压:75V 电流:150mA; Supplier Part: C507292; Manufacturer: MCC(美微科); Supplier Footprint: SOD-523; JLCPCB Part Class: 扩展库; Supplier: LCSC; Reverse Voltage (Vr): 75V; Average Rectified Current (Io): 150mA; Forward Voltage (Vf@If): 1.25V@150mA; Reverse Leakage Current: 1uA@75V; Reverse Recovery Time (trr): 4ns; Operating Temperature: -65℃~+150℃
X6 = FPC-05F-18PH20: 间距:0.5mm;触点数量:18P;锁定特性:翻盖式;触点类型:下接;安装类型:卧贴;工作温度范围:-25℃~+85℃;; LCSC Part Name: 间距:0.5mm P数:18P 翻盖式 下接; Supplier Part: C2856802; Manufacturer: XUNPU(讯普); Supplier Footprint: SMD,P=0.5mm,卧贴; JLCPCB Part Class: 扩展库; Datasheet: https://atta.szlcsc.com/upload/public/pdf/source/20210922/C2856802_2A845D1961F33AEC1ED22CECB292335F.pdf; Supplier: LCSC; Pitch: 0.5mm; Number of Contacts: 18P; Locking Feature: 翻盖式; FFC, FCB Thickness: 0.3mm; Contact Type: 下接; Mounting Type: 卧贴; Height Above Board: 2mm; Operating Temperature Range: -25℃~+85℃
X7 = TF PUSH: 卡连接方式:自弹式;卡类型:MicroSD卡(TF卡);连接器类型:卡座;本体最大高度:2mm;工作温度范围:-20℃~+90℃;; LCSC Part Name: 自弹式 MicroSD卡(TF卡) 卡座; Supplier Part: C393941; Manufacturer: SHOU HAN(首韩); Supplier Footprint: SMD; JLCPCB Part Class: 扩展库; Datasheet: https://atta.szlcsc.com/upload/public/pdf/source/20191011/C393941_0DDD896EE907FEB750D8B7B8982E2A67.pdf; Supplier: LCSC; Card Connection Mode: 自弹式; Card Type: MicroSD卡(TF卡); Connector Type: 卡座; Maximum Body Height: 2mm; Operating Temperature Range: -20℃~+90℃
X8 = 间距:2.54mm 1x10P 卧贴
X9 = X6511FRS-08-C85D30: 插孔结构:1x8P;间距:2.54mm;安装类型:卧贴;排数:单排;总孔位数:8P;塑高:8.5mm;; LCSC Part Name: 间距:2.54mm 1x8P 卧贴; Supplier Part: C5142241; Manufacturer: XKB Connectivity(中国星坤); Supplier Footprint: SMD,P=2.54mm,卧贴; JLCPCB Part Class: 扩展库; Datasheet: https://atta.szlcsc.com/upload/public/pdf/source/20220822/AB9A82E80C220285963E5EFA3BFD32FF.pdf; Supplier: LCSC; Holes Structure: 1x8P; Pitch: 2.54mm; Mounting Type: 卧贴; Number of Rows: 单排; Number of Holes: 8P; Insulation Height: 8.5mm; Check: false
C64 = 0402B473K250NT: 容值:47nF;精度:±10%;额定电压:25V;材质(温度系数):X7R;; LCSC Part Name: 47nF ±10% 25V; Supplier Part: C285062; Manufacturer: FH(风华); Supplier Footprint: 0402; JLCPCB Part Class: Extended Part; Datasheet: https://atta.szlcsc.com/upload/public/pdf/source/20200305/C486355_26A10D38EF8C2A5C37091D0039909270.pdf; Supplier: LCSC; Tolerance: ±10%; Voltage Rated: 25V; Temperature Coefficient: X7R
C65 = GRM155R61E474KE01D: 容值:470nF;精度:±10%;额定电压:25V;材质(温度系数):X5R;; LCSC Part Name: 470nF ±10% 25V; Supplier Part: C437526; Manufacturer: muRata(村田); Supplier Footprint: 0402; JLCPCB Part Class: Extended Part; Datasheet: https://atta.szlcsc.com/upload/public/pdf/source/20220210/B82BA17E61F8206C5D241F3843584A55.pdf; Supplier: LCSC; Tolerance: ±10%; Voltage Rated: 25V; Temperature Coefficient: X5R
C66 C76 C78 C79 C82 = CL10A225KA8NNNC: 容值:2.2uF;精度:±10%;额定电压:25V;材质(温度系数):X5R;; LCSC Part Name: 2.2uF ±10% 25V; Supplier Part: C57895; Manufacturer: SAMSUNG(三星); Supplier Footprint: 0603; JLCPCB Part Class: Extended Part; Datasheet: https://atta.szlcsc.com/upload/public/pdf/source/20160218/1457707763339.pdf; Supplier: LCSC; Tolerance: ±10%; Voltage Rated: 25V; Temperature Coefficient: X5R
DA5 = RS3221-3.3YF3: 输出类型:-;; Supplier Part: C2762323; Manufacturer: RUNIC(润石); Supplier Footprint: SOT-23; JLCPCB Part Class: 扩展库; Datasheet: https://atta.szlcsc.com/upload/public/pdf/source/20210326/C2762324_F2EB8E065FFFE1BF7E1E73455716E1C7.pdf; Supplier: LCSC
DA6 DD7 = LM3281YFQR: 功能类型:降压型;输出类型:固定;输入电压:3V~5.5V;输出电压:3.3V;输出电流(最大值):1.2A;; LCSC Part Name: 降压型 输入3V~5.5V 输出3.3V 1.2A; Supplier Part: C2070970; Manufacturer: TI(德州仪器); Supplier Footprint: BGA-6; JLCPCB Part Class: 扩展库; Datasheet: https://atta.szlcsc.com/upload/public/pdf/source/20230228/A45EF46A53866ADA0477B47A9F8D467A.pdf; Supplier: LCSC; Function: 降压型; Synchronous Rectification: 是; Output Type: 固定; Number of Outputs: 1; Topology: 降压式; Input Voltage: 3V~5.5V; Output Voltage: 3.3V; Output Current (Max): 1.2A; Switching Frequency: 6MHz; Operating Temperature: -30℃~+90℃@(TA)
DD5 = BQ27220YZFR: BQ27220 bq27220 具有集成感应电阻的系统端 Impedance Track&#153; 电量监测计; Supplier Part: C528617; Manufacturer: TI(德州仪器); Supplier Footprint: DSBGA-9; JLCPCB Part Class: 扩展库; Datasheet: https://atta.szlcsc.com/upload/public/pdf/source/20200508/C528617_3298284161F835B74C1639C92E8FD1CF.pdf; Supplier: LCSC
DD6 = BQ25896RTWR: BQ25896 bq25896/7 具有 NVDC 电源路径管理的 I2C 控制 5A 单节 USB/适配器充电器; Supplier: LCSC; Supplier Part: C181475; Manufacturer: TI(德州仪器); JLCPCB Part Class: 扩展库; Supplier Footprint: QFN-24-EP(4x4); Datasheet: https://www.ti.com/cn/lit/gpn/bq25896
L12 = MWTC201610S1R0MT: 电感值:1uH;精度:±20%;额定电流:3.4A;饱和电流(Isat):4.6A;; LCSC Part Name: 1uH ±20% 4.6A; Supplier Part: C2840989; Manufacturer: Sunlord(顺络); Supplier Footprint: SMD,2x1.6x1mm; JLCPCB Part Class: 扩展库; Datasheet: https://atta.szlcsc.com/upload/public/pdf/source/20231010/25FD0151D596D0B425E08DF171F02391.pdf; Supplier: LCSC; Tolerance: ±20%; Rated Current: 3.4A; DC Resistance (DCR): 42mΩ; Saturation Current (Isat): 4.6A
L13-L15 = WIP201610P-R47ML: 电感值:470nH;精度:±20%;额定电流:3.15A;饱和电流(Isat):4A;; LCSC Part Name: 470nH ±20% 3.15A 33mΩ; Supplier Part: C964105; Manufacturer: INPAQ(佳邦); Supplier Footprint: SMD; JLCPCB Part Class: 扩展库; Datasheet: https://atta.szlcsc.com/upload/public/pdf/source/20181022/C315716_08E9DB17D82CB1F96C1ECEC7E5AE09CA.pdf; Supplier: LCSC; Tolerance: ±20%; Rated Current: 3.15A; Saturation Current (Isat): 4A; DC Resistance (DCR): 33mΩ
Q1 = MMDT2907A-7-F: 直流电流增益(hFE@Ic,Vce):100@150mA,10V;功率(Pd):200mW;集射极击穿电压(Vceo):60V;集电极电流(Ic):600mA;晶体管类型:2个PNP;; Supplier: LCSC; Supplier Part: C460232; Manufacturer: DIODES(美台); JLCPCB Part Class: 扩展库; LCSC Part Name: 耐压:60V 电流:600mA 2个PNP; Supplier Footprint: SOT-363; Datasheet: https://atta.szlcsc.com/upload/public/pdf/source/20191127/C460232_4FC716E12AFDB3893286BD629E58921B.pdf; DC Current Gain (hFE@Ic,Vce): 100@150mA,10V; Power Dissipation (Pd): 200mW; Transition Frequency (fT): 200MHz; Collector-Emitter Breakdown Voltage (Vceo): 60V; Collector Current (Ic): 600mA; Collector Cut-Off Current (Icbo): 10nA; Collector-Emitter Saturation Voltage (VCE(sat)@Ic,Ib): 1.6V@500mA,50mA; Transistor Type: 2个PNP; Operating Temperature: -55℃~+150℃@(Tj)
R3 R4 = RC0402FR-07100KL: 电阻类型:厚膜电阻;阻值:100kΩ;精度:±1%;功率:62.5mW;; LCSC Part Name: 100kΩ ±1% 62.5mW; Supplier Part: C60491; Manufacturer: YAGEO(国巨); Supplier Footprint: 0402; JLCPCB Part Class: Extended Part; Datasheet: https://atta.szlcsc.com/upload/public/pdf/source/20170518/1495086055123.pdf; Supplier: LCSC; Type: 厚膜电阻; Tolerance: ±1%; Power(Watts): 62.5mW; Temperature Coefficient: ±100ppm/℃; Overload Voltage (Max): 50V; Operating Temperature Range: -55℃~+155℃
R16 R70 = RC0402FR-071R5L: 电阻类型:厚膜电阻;阻值:1.5Ω;精度:±1%;功率:62.5mW;最大工作电压:50V;温度系数:±200ppm/℃;; LCSC Part Name: 厚膜电阻 1.5Ω ±1% 62.5mW; Supplier Part: C327253; Manufacturer: YAGEO(国巨); Supplier Footprint: 0402; JLCPCB Part Class: Extended Part; Datasheet: https://atta.szlcsc.com/upload/public/pdf/source/20181031/C327253_FD956C9BBBE5A762C9F33EFA017DA00B.pdf; Supplier: LCSC; Type: 厚膜电阻; Tolerance: ±1%; Power(Watts): 62.5mW; Overload Voltage (Max): 50V; Temperature Coefficient: ±200ppm/℃; Operating Temperature Range: -55℃~+155℃
R34 R35 R44 R46 R47 = RC0402FR-0710KL: 电阻类型:厚膜电阻;阻值:10kΩ;精度:±1%;功率:62.5mW;; LCSC Part Name: 10kΩ ±1% 62.5mW; Supplier Part: C60490; Manufacturer: YAGEO(国巨); Supplier Footprint: 0402; JLCPCB Part Class: Extended Part; Datasheet: https://atta.szlcsc.com/upload/public/pdf/source/20170606/1496716515432.pdf; Supplier: LCSC; Type: 厚膜电阻; Tolerance: ±1%; Power(Watts): 62.5mW; Temperature Coefficient: ±100ppm/℃; Overload Voltage (Max): 50V; Operating Temperature Range: -55℃~+155℃
R36 = 0402WGF4700TCE: 阻值:470Ω;精度:±1%;功率:62.5mW;温度系数:±100ppm/℃;电阻类型:厚膜电阻;; LCSC Part Name: 470Ω ±1% 62.5mW 厚膜电阻; Supplier Part: C25117; Manufacturer: UNI-ROYAL(厚声); Supplier Footprint: 0402; JLCPCB Part Class: Basic Part; Datasheet: https://atta.szlcsc.com/upload/public/pdf/source/20200306/C422600_1E6D84923E4A46A82E41ADD87F860B5C.pdf; Supplier: LCSC; Tolerance: ±1%; Power(Watts): 62.5mW; Overload Voltage (Max): 50V; Temperature Coefficient: ±100ppm/℃; Type: 厚膜电阻; Operating Temperature Range: -55℃~+155℃
R37 = RLP25FEGR010: 阻值:10mΩ;精度:±1%;功率:3W;; LCSC Part Name: 10mΩ ±1% 3W; Supplier Part: C393070; Manufacturer: 大毅科技; Supplier Footprint: 2512; JLCPCB Part Class: Extended Part; Datasheet: https://atta.szlcsc.com/upload/public/pdf/source/20190614/C393070_2745FAF1A0F67D16246ACC5358362128.pdf; Supplier: LCSC; Tolerance: ±1%; Power(Watts): 3W; Temperature Coefficient: ±50ppm/℃
R38 = ERJ2RKF5231X: 阻值:5.23kΩ;精度:±1%;功率:100mW;温度系数:±100ppm/℃;电阻类型:厚膜电阻;; LCSC Part Name: 5.23kΩ ±1% 100mW 厚膜电阻; Supplier Part: C409919; Manufacturer: PANASONIC(松下); Supplier Footprint: 0402; JLCPCB Part Class: Extended Part; Datasheet: https://atta.szlcsc.com/upload/public/pdf/source/20190806/C409919_5870A523B4D8515C8F02F87F090735B5.pdf; Supplier: LCSC; Tolerance: ±1%; Power(Watts): 100mW; Temperature Coefficient: ±100ppm/℃; Type: 厚膜电阻; Operating Temperature Range: -55℃~+155℃
R39 = 0402WGF3012TCE: 阻值:30.1kΩ;精度:±1%;功率:62.5mW;温度系数:±100ppm/℃;电阻类型:厚膜电阻;; LCSC Part Name: 30.1kΩ ±1% 62.5mW 厚膜电阻; Supplier Part: C29402; Manufacturer: UNI-ROYAL(厚声); Supplier Footprint: 0402; JLCPCB Part Class: Extended Part; Datasheet: https://atta.szlcsc.com/upload/public/pdf/source/20200306/C422600_1E6D84923E4A46A82E41ADD87F860B5C.pdf; Supplier: LCSC; Tolerance: ±1%; Power(Watts): 62.5mW; Overload Voltage (Max): 50V; Temperature Coefficient: ±100ppm/℃; Type: 厚膜电阻; Operating Temperature Range: -55℃~+155℃
R40-R42 = 0402WGF1501TCE: 阻值:1.5kΩ;精度:±1%;功率:62.5mW;温度系数:±100ppm/℃;电阻类型:厚膜电阻;; LCSC Part Name: 1.5kΩ ±1% 62.5mW 厚膜电阻; Supplier Part: C25867; Manufacturer: UNI-ROYAL(厚声); Supplier Footprint: 0402; JLCPCB Part Class: Basic Part; Datasheet: https://atta.szlcsc.com/upload/public/pdf/source/20200306/C422600_1E6D84923E4A46A82E41ADD87F860B5C.pdf; Supplier: LCSC; Tolerance: ±1%; Power(Watts): 62.5mW; Overload Voltage (Max): 50V; Temperature Coefficient: ±100ppm/℃; Type: 厚膜电阻; Operating Temperature Range: -55℃~+155℃
R43 = NCP18XH103F03RB: 阻值(25℃):10kΩ;电阻精度:±1%;B值精度:±1%;B值(25℃/50℃):3380K;功率:100mW;最大稳态电流(25℃):310uA;B值(25℃/75℃):-;B值(25℃/85℃):3334K;B值(25℃/100℃):3455K;工作温度:-40℃~+125℃;; LCSC Part Name: 10kΩ 电阻精度:±1% 3380K; Supplier Part: C13564; Manufacturer: muRata(村田); Supplier Footprint: 0603; JLCPCB Part Class: Extended Part; Supplier: LCSC; Resistance @ 25℃: 10kΩ; Resistance Tolerance: ±1%; B Constant Tolerance: ±1%; B Constant (25℃/50℃): 3380K; Power: 100mW; Steady State Current (Max): 310uA; B Constant (25℃/85℃): 3334K; B Constant (25℃/100℃): 3455K; Operating Temperature: -40℃~+125℃
R45 = 0402WGF1000TCE: 阻值:100Ω;精度:±1%;功率:62.5mW;温度系数:±200ppm/℃;电阻类型:厚膜电阻;; LCSC Part Name: 100Ω ±1% 62.5mW 厚膜电阻; Supplier Part: C25076; Manufacturer: UNI-ROYAL(厚声); Supplier Footprint: 0402; JLCPCB Part Class: Basic Part; Datasheet: https://atta.szlcsc.com/upload/public/pdf/source/20200306/C422600_1E6D84923E4A46A82E41ADD87F860B5C.pdf; Supplier: LCSC; Tolerance: ±1%; Power(Watts): 62.5mW; Overload Voltage (Max): 50V; Temperature Coefficient: ±200ppm/℃; Type: 厚膜电阻; Operating Temperature Range: -55℃~+155℃
R48 R71 = RC-02U3R30FT: 电阻类型:厚膜电阻;阻值:3.3Ω;精度:±1%;功率:62.5mW;最大工作电压:50V;温度系数:±400ppm/℃;; LCSC Part Name: 厚膜电阻 3.3Ω ±1% 62.5mW; Supplier Part: C321181; Manufacturer: FH(风华); Supplier Footprint: 0402; JLCPCB Part Class: Extended Part; Datasheet: https://atta.szlcsc.com/upload/public/pdf/source/20140616/1457707091974.pdf; Supplier: LCSC; Type: 厚膜电阻; Tolerance: ±1%; Power(Watts): 62.5mW; Overload Voltage (Max): 50V; Temperature Coefficient: ±400ppm/℃; Operating Temperature Range: -55℃~+155℃
SB5 SB6 = SOLDERBRIDGE_SHORTED: Check: false
VD37 = 1N4148WT_C727112: 二极管配置:独立式;正向压降(Vf):1.25V@150mA;直流反向耐压(Vr):75V;平均整流电流(Io):100mA;功率:150mW;反向恢复时间(trr):4ns;; LCSC Part Name: 电压:75V 电流:100mA; Supplier Part: C727112; Manufacturer: TWGMC(台湾迪嘉); Manufacturer Part: 1N4148WT; Supplier Footprint: SOD-523; JLCPCB Part Class: 扩展库; Datasheet: https://atta.szlcsc.com/upload/public/pdf/source/20200828/C727112_FCA71CBB186A515518FBD85DA79D41CF.pdf; Supplier: LCSC; Diode Configuration: 独立式; Forward Voltage (Vf@If): 1.25V@150mA; Reverse Voltage (Vr): 75V; Average Rectified Current (Io): 100mA; Power Dissipation: 150mW; Reverse Leakage Current: 1uA@75V; Reverse Recovery Time (trr): 4ns; Operating Temperature: -65℃~+150℃@(Tj); Check: false
VT1 = DMP1045U-7: 类型:P沟道;漏源电压(Vdss):12V;连续漏极电流(Id):4A;功率(Pd):800mW;导通电阻(RDS(on)@Vgs,Id):31mΩ@4.5V,4A;; LCSC Part Name: P沟道 12V 4A; Supplier Part: C177033; Manufacturer: DIODES(美台); Supplier Footprint: SOT-23; JLCPCB Part Class: 扩展库; Datasheet: https://atta.szlcsc.com/upload/public/pdf/source/20180725/C177033_EFAD3680968319EA3CC6226C29CAC432.pdf; Supplier: LCSC; Type: P沟道; Drain Source Voltage (Vdss): 12V; Continuous Drain Current (Id): 4A; Power Dissipation (Pd): 800mW; Drain Source On Resistance (RDS(on)@Vgs,Id): 31mΩ@4.5V,4A; Gate Threshold Voltage (Vgs(th)@Id): 1V@250uA; Total Gate Charge (Qg@Vgs): 15.8nC@4.5V; Input Capacitance (Ciss@Vds): 1.357nF@10V; Operating Temperature: -55℃~+150℃@(Tj)
VT5 = DMN313DLT-7: 类型:N沟道;漏源电压(Vdss):30V;连续漏极电流(Id):270mA;功率(Pd):280mW;导通电阻(RDS(on)@Vgs,Id):2Ω@4V,10mA;; LCSC Part Name: N沟道 耐压:30V 电流:270mA; Supplier Part: C155524; Manufacturer: DIODES(美台); Supplier Footprint: SOT-523-3; JLCPCB Part Class: 扩展库; Datasheet: https://atta.szlcsc.com/upload/public/pdf/source/20180307/C155524_15204109726361407920.pdf; Supplier: LCSC; Type: N沟道; Drain Source Voltage (Vdss): 30V; Continuous Drain Current (Id): 270mA; Power Dissipation (Pd): 280mW; Drain Source On Resistance (RDS(on)@Vgs,Id): 2Ω@4V,10mA; Gate Threshold Voltage (Vgs(th)@Id): 1.5V@250uA; Total Gate Charge (Qg@Vgs): 500pC@4.5V; Input Capacitance (Ciss@Vds): 36.3pF@5V; Operating Temperature: -55℃~+150℃@(Tj)
X10 = 1.25T-3P卧贴: 插针结构:1x3P;间距:1.25mm;安装方式:-;参考系列:-;总PIN数:3P;排数:1;每排PIN数:3;行距:-;触头材质:磷青铜;; LCSC Part Name: 间距:1.25mm 1x3P; Supplier Part: C22075; Manufacturer: BOOMELE(博穆精密); Supplier Footprint: SMD,P=1.25mm; JLCPCB Part Class: 扩展库; Datasheet: https://atta.szlcsc.com/upload/public/pdf/source/20171115/C145988_15107293531801120472.pdf; Supplier: LCSC; Pins Structure: 1x3P; Pitch: 1.25mm; Number of Pins: 3P; Number of Rows: 1; Number of PINs Per Row: 3; Contact Material: 磷青铜

## Nets
3.3V: 3V32.1 C9.2 C12.1 C13.1 C14.1 C15.1 C16.1 C17.1 C18.1 C19.1 C23.1 C24.1 C88.1 DD1.14(VDDA) DD1.30(VDD) DD1.33(VDDRF) DD1.44(VDDSMPS) DD1.45(VDD) DD1.55(VDDUSB) DD1.68(VDD) R5.1 R34.1 R40.2 R41.2 R42.2 R47.2 R48.2 R71.2 VD26.1 X6.3 ; also on sheet 5 6 7
GND: BLE1.3(GND) C1.2 C2.1 C3.1 C4.1 C5.2 C6.2 C7.2 C8.2 C9.1 C10.1 C12.2 C13.2 C14.2 C15.2 C16.2 C17.2 C18.2 C19.2 C20.2 C21.2 C22.2 C23.2 C24.2 C41.1 C59.1 C60.2 C61.2 C63.1 C65.1 C66.1 C67.1 C68.1 C69.1 C70.1 C71.1 C72.1 C73.1 C74.1 C75.1 C77.1 C80.1 C81.1 C83.1 C88.2 DA4.A3(CLK_32K) DA4.B1(ADDR_SEL1) DA4.B2(ADDR_SEL0) DA4.B3(GND) DA5.1(GND) DD1.32(VSSRF) DD1.42(VSSSMPS) DD1.69(EP) DD5.B2(VSS) DD6.2(PSEL) DD6.9(CE) DD6.17(PGND) DD6.18(PGND) DD6.25(EPAD) FLT1.1(GND) FLT1.3(GND) GND1.1 GND2.1 GND3.1 GND4.1 R1.1 R2.1 R3.1 R4.1 R35.2 R36.1 R39.2 R43.1 R46.1 SB5.1(0) SB6.1(0) VD1.2 VD2.2 VD3.2 VD5.1 VD6.1 VD7.1 VD8.1 VD9.1 VD10.1 VD12.1 VD13.1 VD14.1 VD15.1 VD16.1 VD17.1 VD18.1 VD19.1 VD20.1 VD21.1 VD22.1 VD23.1 VD24.1 VD25.1 VD26.2 VT5.2(S) X6.6 X6.8 X7.6(VSS) X7.10 X7.11 X7.12 X7.13 X8.3 X8.10 X9.8 X10.3 ZQ2.2(GND) ZQ2.4(GND) ZQC1.1 ZQC2.1 ; also on sheet 5 6 7
PGND: C79.1 C82.1 DA6.C2(GND) SB5.2(1)
PGND2: C76.1 C78.1 DD7.C2(GND) SB6.2(1)
VBUS: C1.1 Q1.4(E2) R45.1 VBUS1.1 VBUS2.1 VD1.1 VD37.1(C) VT1.3(D) X1.2(VBUS) X1.11(VBUS)
BAT: BAT1.1 BAT2.1 C63.2 DD5.C1(SRP) DD5.C3(BAT) R37.2 X10.1
BUTTON_BACK: DD1.2(PC13) DD6.12(QON) ; also on sheet 7
BUTTON_DOWN: DD1.50(PC6) ; also on sheet 7
BUTTON_LEFT: DD1.29(PB11) ; also on sheet 7
BUTTON_OK: BOOT.1 DD1.5(PH3-BOOT0) ; also on sheet 7
BUTTON_RIGHT: DD1.46(PB12) ; also on sheet 7
BUTTON_UP: DD1.28(PB10) ; also on sheet 7
CC1101_CS: DD1.61(PD0) ; also on sheet 6
CC1101_G0: DD1.16(PA1) ; also on sheet 6
D1_N: D-.1 DD1.52(PA11) R8.2
D1_P: D+.1 DD1.53(PA12) R5.2 R9.2
D2_N: R8.1 VD2.1 X1.5(DN2) X1.7(DN1)
D2_P: R9.1 VD3.1 X1.6(DP1) X1.8(DP2)
DISPLAY_CS: DD1.59(PC11) ; also on sheet 5
DISPLAY_DI: DD1.39(PB1) ; also on sheet 5
DISPLAY_RST: DD1.38(PB0) ; also on sheet 5
EXT3.3V: C77.2 C78.2 C83.2 DD7.A1(FB) EXT3V3.1 EXT3V32.1 L13.2 R20.1 VD12.2 X8.1
I2C_SCL: DA4.C2(SCL) DD1.24(PA9) DD5.A3(SCL) DD6.5(SCL) I2C_SCL.1 R41.1
I2C_SDA: DA4.C1(SDA) DD1.51(PA10) DD5.A2(SDA) DD6.6(SDA) I2C_SDA.1 R40.1
IBTN: DD1.48(PB14) IBTN.1 R32.8 R69.2 VD19.2 X6.14
IR_RX: DD1.15(PA0) IR_RX.1 X6.17
IR_TX: DD1.7(PB9) IR_TX.1 X6.16
LCD_LED: DA4.A1(W) ; also on sheet 5
LDO_3.3V: C75.2 DA5.2(VOUT) DD1.1(VBAT) LDO1.1 LDO2.1
NFC_CS: DD1.40(PE4) NFC_CS.1 X6.4
PA4: DD1.19(PA4) R33.5 VD16.2
PA6: DD1.21(PA6) R10.8 VD17.2
PA7: DD1.22(PA7) R10.7 VD18.2
PB2: DD1.27(PB2) R33.7 VD14.2
PB3: DD1.63(PB3) R33.6 VD15.2
PC0: DD1.9(PC0) R32.7 VD20.2
PC1: DD1.10(PC1) R32.6 VD21.2
PC3: DD1.12(PC3) R33.8 VD13.2
PERIPH_POWER: DD1.18(PA3) DD7.C1(EN) R47.1
RESET: C41.2 DA4.C3(EN/VCC) DD1.8(NRST) NRST.1 ; also on sheet 7
RF_SW_0: DD1.25(PC4) ; also on sheet 6
RFID_CARRIER: DD1.57(PA15) RFID_CARRIER.1 X6.18
RFID_OUT: DD1.47(PB13) RFID_OUT.1 X6.12
RFID_PULL: DD1.17(PA2) RFID_PULL.1 X6.11
RFID_RF_IN: DD1.26(PC5) RFID_IN.1 X6.5
SD_CD: DD1.58(PC10) R31.2 R68.2 VD5.2
SD_CS: DD1.60(PC12) R23.2 VD10.2
SPEAKER: DD1.6(PB8) SPEAKER.1 X6.15
SPI_D_MISO: D_MI.1 DD1.11(PC2) R28.2 R65.2 VD7.2
SPI_D_MOSI: C2.2 D_MO.1 DD1.49(PB15) R24.2 R67.2 VD9.2 ; also on sheet 5
SPI_D_SCK: C3.2 D_SCK.1 DD1.62(PD1) R26.2 R66.2 VD8.2 ; also on sheet 5
SPI_R_MISO: DD1.64(PB4) R29.2 R_MI.1 ; also on sheet 6
SPI_R_MOSI: R7.1 R_MO.1 X6.13 ; also on sheet 6
SPI_R_SCK: R6.2 R_CLK.1 X6.7 ; also on sheet 6
SWCLK: DD1.56(PA14) R11.6 SWCLK.1 VD25.2
SWDIO: DD1.54(PA13) R11.7 SWDIO.1 VD24.2
SYS: C59.2 C67.2 C68.2 C76.2 C79.2 DA4.A2(VDD) DA6.A2(VIN) DA6.B1(MODE) DA6.C1(EN) DD6.15(SYS) DD6.16(SYS) DD7.A2(VIN) DD7.B1(MODE) L12.2 R44.2 SYS1.1 SYS2.1 VD4.4(+) X6.1 X6.2 ; also on sheet 5
UART1_RX: DD1.67(PB7) R32.5 VD22.2
UART1_TX: DD1.66(PB6) R11.8 VD23.2
USB_5V: 5V1.1 5V2.1 C69.2 DD6.1(VBUS) FU4.2 Q1.1(E1) VD11.2 VD36.2(A) VT1.2(S)
VIBRO: DD1.23(PA8) VIBRO.1 X6.10
$2N613: C70.2 DD6.23(PMID)
$2N691: DD6.10(LIIM) R36.2
$2N809: DD6.4(STAT) STAT.1
$2N812: DD6.3(PG) PG.1
$2N1060: DD6.7(INT) PWR_INT.1 R42.1
$2N1256: DD6.8(OTG) OTG.1 R44.1 VT5.3(D)
$2N1342: R45.2 R46.2 VT5.1(G)
$2N1479: C64.2 DD6.21(BTST)
$2N1565: C64.1 DD6.19(SW) DD6.20(SW) L12.1
$2N1973: C73.2 DD6.22(REGN) R38.2
$2N3432: DD5.A1(GPOUT) GPOUT.1 R34.2
$2N3528: C65.2 C66.2 DD5.B3(VDD)
$2N3766: DD5.B1(BIN) R35.1
$2N4046: X10.4 X10.5
$2N4100: DD6.11(TS) R38.1 R39.1 R43.2 TEMP.1 X10.2
$2N4305: C71.2 C72.2 C74.2 DA5.3(VIN) DD5.C2(SRN) DD6.13(BAT) DD6.14(BAT) R37.1
$2N5893: DD7.B2(SW) L13.1
$2N6264: DA6.B2(SW) L14.1
$2N6384: L14.2 R16.1 R70.1
$2N6663: C80.2 C81.2 C82.2 DA6.A1(FB) L15.1 R16.2 R70.2
$2N6748: L15.2 R48.1 R71.1
$2N18437: Q1.2(B1) Q1.3(C2) Q1.5(B2) R3.2 VD37.2(A)
$2N18539: Q1.6(C1) R4.2 VT1.1(G)
$3N1149: R10.2 X9.2
$3N1159: R10.1 X9.3
$3N1166: R33.4 X9.4
$3N1174: R33.3 X9.5
$3N1179: R33.2 X9.6
$3N1184: R33.1 X9.7
$3N1374: C62.1 VD11.1
$3N1382: C62.2 FU4.1 X9.1
$3N2276: R11.3 X8.2
$3N2313: R32.1 X8.9
$3N2397: I2C_SCL2.1 R32.2 X8.8
$3N2408: I2C_SDA2.1 R32.3 X8.7
$3N2419: R32.4 UART1_RX.1 X8.6
$3N2428: R11.1 UART1_TX.1 X8.5
$3N2553: R11.2 X8.4
$3N2752: X6.19 X6.20
$3N2979: R69.1 VD36.1(C)
$3N3125: R29.1 X6.9
$3N5811: DA4.A4(B) R30.2
$3N5820: DA4.B4(G) R27.2
$3N5825: DA4.C4(R) R25.2
$3N5919: R25.1 VD4.1(R-)
$3N5924: R30.1 VD4.3(B-)
$3N5929: R27.1 VD4.2(G-)
$3N6823: R23.1 X7.2(CD/DAT3)
$3N6873: R24.1 X7.3(CMD)
$3N6971: R26.1 X7.5(CLX)
$3N7047: R28.1 X7.7(DAT0)
$3N7095: R31.1 X7.CD
$3N7977: C60.1 C61.1 R20.2 R21.1 R22.1 R65.1 R66.1 R67.1 R68.1 VD6.2 X7.4(VDD)
$3N7993: R21.2 X7.8(DAT1)
$3N7997: R22.2 X7.1(DAT2)
$4N796: DD1.20(PA5) R6.1
$4N1627: X1.1(GND) X1.12(GND) X1.13(SHELL) X1.14(SHELL)
$4N1760: R2.2 X1.4(CC1)
$4N1769: R1.2 X1.10(CC2)
$4N2177: C4.2 DD1.3(PC14-OSC32_IN) ZQ1.2
$4N2479: C10.2 DD1.4(PC15-OSC32_OUT) ZQ1.1
$4N2778: DD1.35(OSC_IN) ZQ2.1(OSC1) ZQC1.2
$4N2789: DD1.34(OSC_OUT) ZQ2.3(OSC2) ZQC2.2
$4N2962: DD1.65(PB5) R7.2
$4N3528: C5.1 DD1.31(RF1) L1.1
$4N3680: C6.1 FLT1.4(IN) L1.2
$4N4945: C21.1 C22.1 DD1.13(VREF+)
$4N5165: DD1.43(VLXSMPS) L3.2
$4N5257: C20.1 DD1.41(VFBSMPS) L3.1
$4N7016: BLE1.1(IN) C7.1 R72.2
$4N16866: ANT1.1 L2.2
$4N16967: BLE1.2(OUT) L2.1
$4N21078: C8.1 FLT1.2(OUT) R72.1

Not connected (* = marked no-connect by the designer): ANT1 2*; DD1 36(AT0)* 37(AT1)*; DD6 24(NC)*; R10 3* 4* 5* 6*; R11 4* 5*; X1 3(SBU2)* 9(SBU1)*

## Notes on the sheets
sheet 4
- 电路设计看天线的数据手册
